# Altium project PCB_Project.PrjPcb
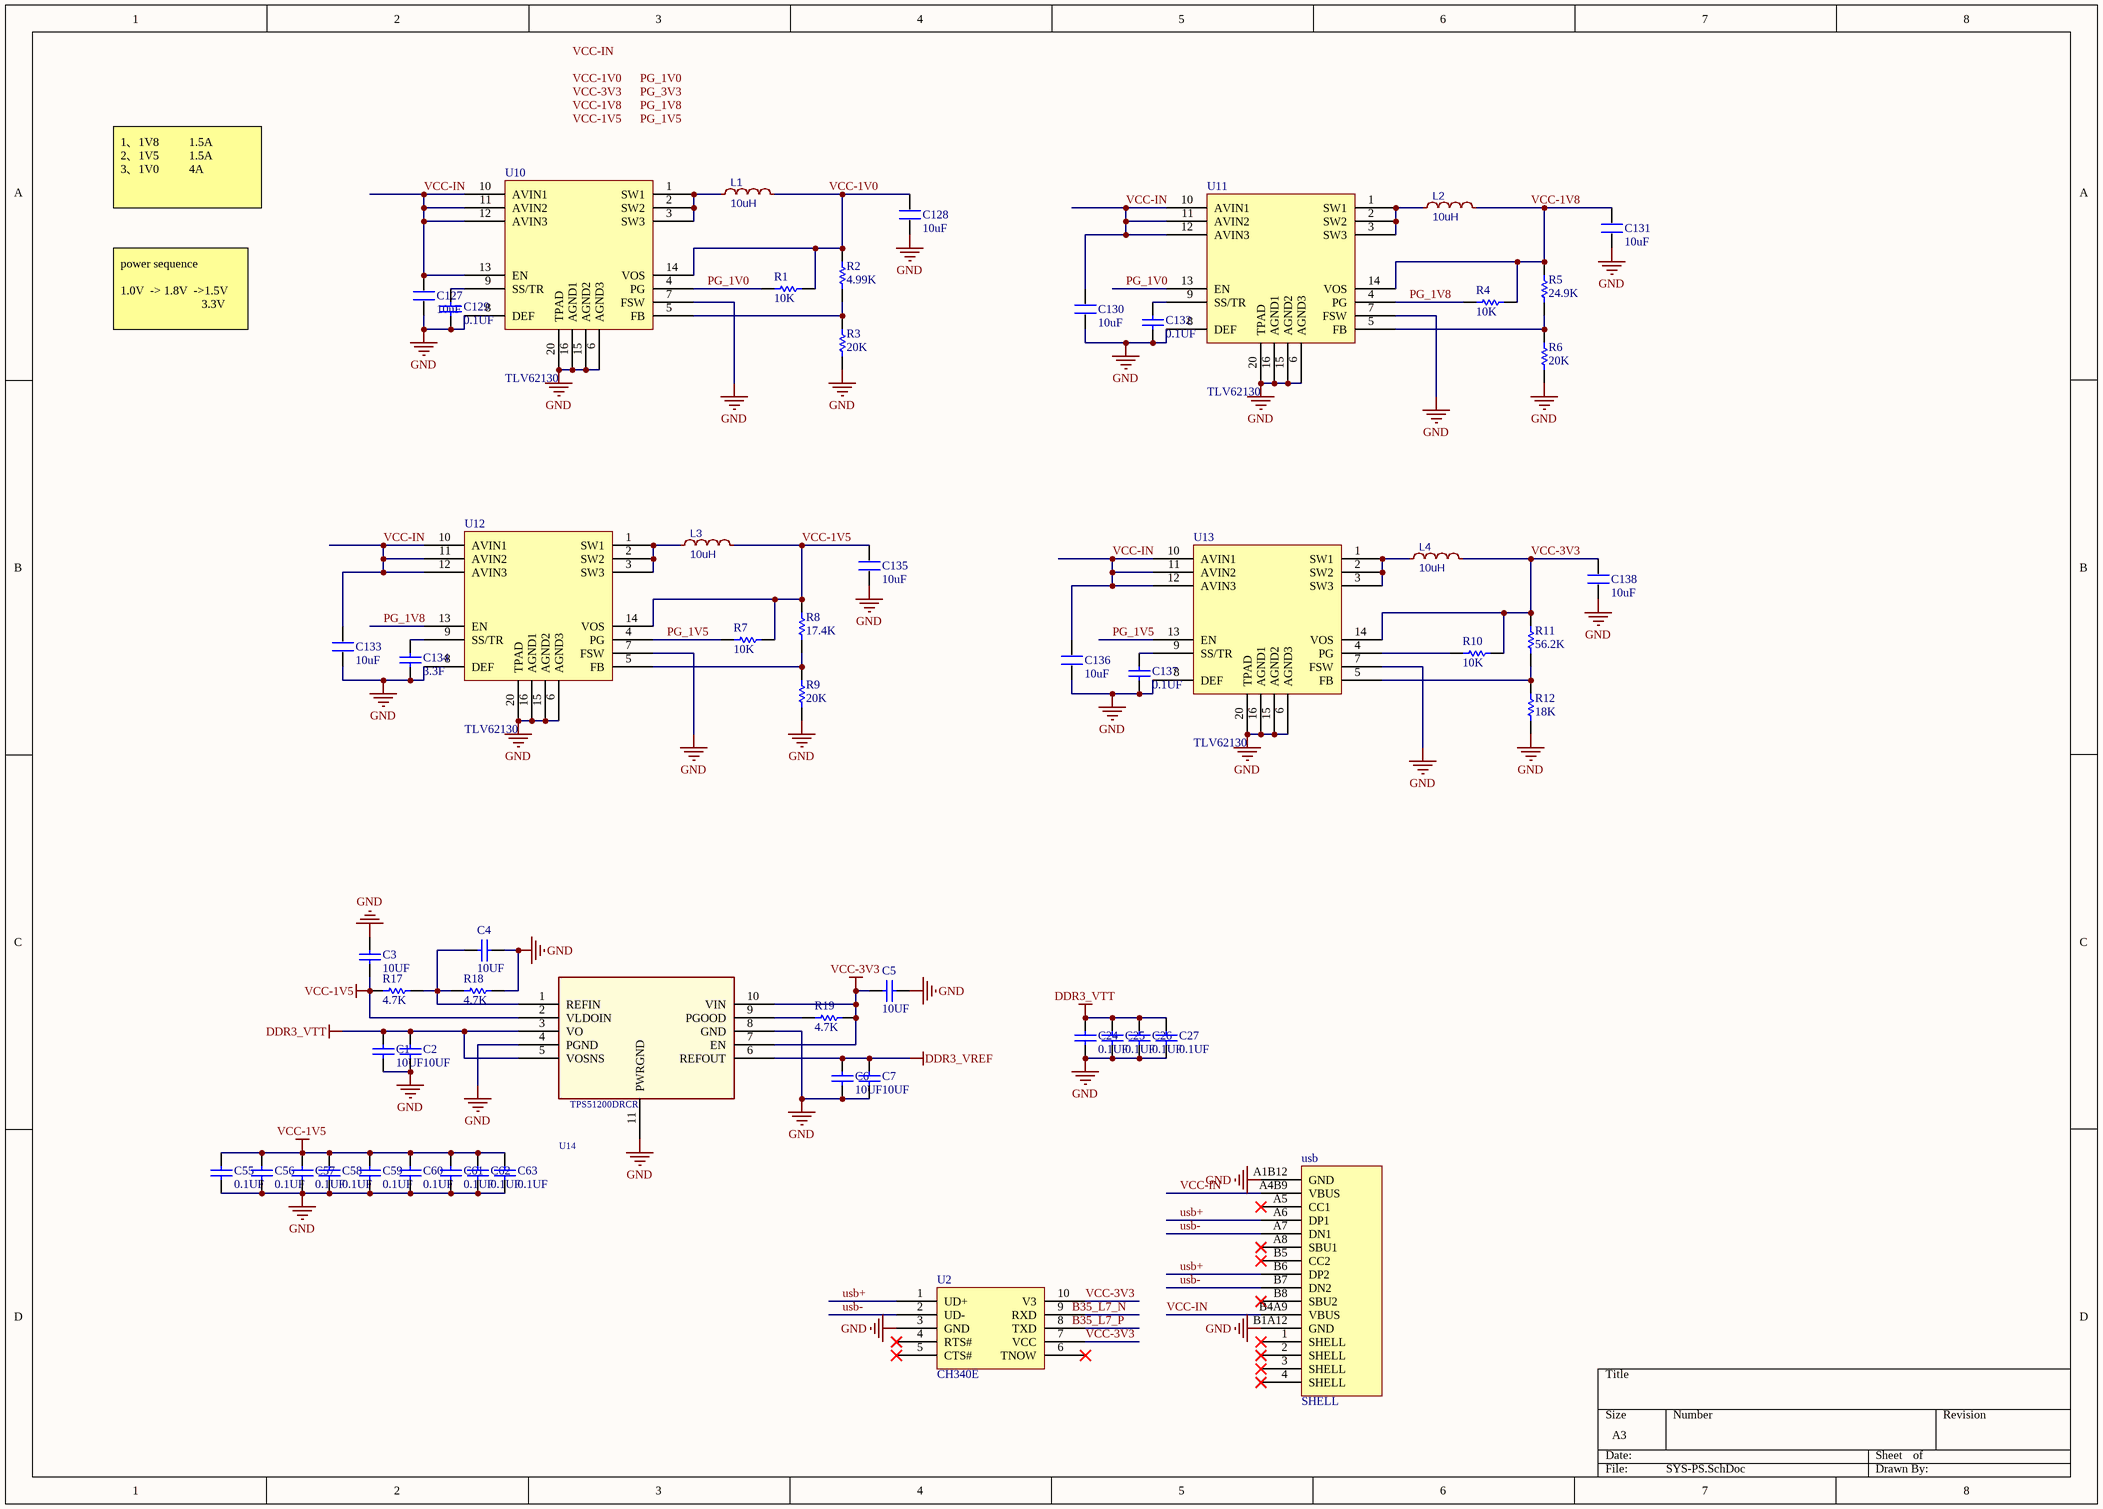
[diagram p0: SYS-PS.SchDoc]
6 sheets, 159 parts. Net scope: global (net labels, ports and power ports of the same name join across sheets).
Board file: PCB1.PcbDoc
Sheets:
  SYS-PS.SchDoc
  ZYNQ400-CONDIP.SchDoc
  ZYNQ400-DDR.SchDoc
  ZYNQ400-EMIO.SchDoc
  ZYNQ400-MIO.SchDoc
  ZYNQ400-POWER.SchDoc

## Sheet SYS-PS.SchDoc
size A3

### Parts
C1  10UF  [0402]
C2  10UF  [0402]
C3  10UF  [0402]
C4  10UF  [0402]
C5  10UF  [0402]
C6  10UF  [0402]
C7  10UF  [0402]
C24  0.1UF  [0402]
C25  0.1UF  [0402]
C26  0.1UF  [0402]
C27  0.1UF  [0402]
C55  0.1UF  [0402]
C56  0.1UF  [0402]
C57  0.1UF  [0402]
C58  0.1UF  [0402]
C59  0.1UF  [0402]
C60  0.1UF  [0402]
C61  0.1UF  [0402]
C62  0.1UF  [0402]
C63  0.1UF  [0402]
C127  10uF  [C0805]
C128  10uF  [C0805]
C129  0.1UF  [0402]
C130  10uF  [C0805]
C131  10uF  [C0805]
C132  0.1UF  [0402]
C133  10uF  [C0805]
C134  3.3F  [0402]
C135  10uF  [C0805]
C136  10uF  [C0805]
C137  0.1UF  [0402]
C138  10uF  [C0805]
L1  10uH  [L1008]
L2  10uH  [L1008]
L3  10uH  [L1008]
L4  10uH  [L1008]
R1  10K  [0402]
R2  4.99K  [0402]
R3  20K  [0402]
R4  10K  [0402]
R5  value 24.9K  [0402]  (hidden comment: 4.99K)
R6  value 20K  [0402]  (hidden comment: 15K)
R7  10K  [0402]
R8  value 17.4K  [0402]  (hidden comment: 4.99K)
R9  value 20K  [0402]  (hidden comment: 15K)
R10  10K  [0402]
R11  value 56.2K  [0402]  (hidden comment: 4.99K)
R12  value 18K  [0402]  (hidden comment: 15K)
R17  value 4.7K  [0402]  (hidden comment: 1K)
R18  value 4.7K  [0402]  (hidden comment: 1K)
R19  value 4.7K  [0402]  (hidden comment: 1K)
U2  CH340E  [CH340E]
U10  TLV62130  [TLV62130RGT]
U11  TLV62130  [TLV62130RGT]
U12  TLV62130  [TLV62130RGT]
U13  TLV62130  [TLV62130RGT]
U14  TPS51200DRCR  [TPS_QFN10]
usb  SHELL  [USB-C-SMD_TYPE-C16PIN_C668624]

### Nets
DDR3_VREF: C6.2 C7.2 U14.6(REFOUT)
DDR3_VTT: C1.2 C2.2 C24.2 C25.2 C26.2 C27.2 U14.3(VO) U14.5(VOSNS)
GND: C1.1 C2.1 C3.1 C4.2 C5.2 C6.1 C7.1 C24.1 C25.1 C26.1 C27.1 C55.1 C56.1 C57.1 C58.1 C59.1 C60.1 C61.1 C62.1 C63.1 C127.1 C128.1 C129.1 C130.1 C131.1 C132.1 C133.1 C134.1 C135.1 C136.1 C137.1 C138.1 R3.1 R6.1 R9.1 R12.1 R18.2 U2.3(GND) U10.6(AGND3) U10.7(FSW) U10.8(DEF) U10.15(AGND2) U10.16(AGND1) U10.20(TPAD) U11.6(AGND3) U11.7(FSW) U11.8(DEF) U11.15(AGND2) U11.16(AGND1) U11.20(TPAD) U12.6(AGND3) U12.7(FSW) U12.8(DEF) U12.15(AGND2) U12.16(AGND1) U12.20(TPAD) U13.6(AGND3) U13.7(FSW) U13.8(DEF) U13.15(AGND2) U13.16(AGND1) U13.20(TPAD) U14.4(PGND) U14.8(GND) U14.11(PWRGND) usb.A1B12(GND) usb.B1A12(GND)
VCC-1V5: C3.2 C55.2 C56.2 C57.2 C58.2 C59.2 C60.2 C61.2 C62.2 C63.2 C135.2 L3.2 R7.2 R8.2 R17.1 U12.14(VOS) U14.2(VLDOIN)
VCC-3V3: C5.1 C138.2 L4.2 R10.2 R11.2 R19.2 U2.7(VCC) U2.10(V3) U13.14(VOS) U14.7(EN) U14.10(VIN)
PG_1V0: R1.1 U10.4(PG) U11.13(EN)
PG_1V5: R7.1 U12.4(PG) U13.13(EN)
PG_1V8: R4.1 U11.4(PG) U12.13(EN)
usb+: U2.1(UD+) usb.A6(DP1) usb.B6(DP2)
usb-: U2.2(UD-) usb.A7(DN1) usb.B7(DN2)
VCC-1V0: C128.2 L1.2 R1.2 R2.2 U10.14(VOS)
VCC-1V8: C131.2 L2.2 R4.2 R5.2 U11.14(VOS)
VCC-IN: C127.2 C130.2 C133.2 C136.2 U10.10(AVIN1) U10.11(AVIN2) U10.12(AVIN3) U10.13(EN) U11.10(AVIN1) U11.11(AVIN2) U11.12(AVIN3) U12.10(AVIN1) U12.11(AVIN2) U12.12(AVIN3) U13.10(AVIN1) U13.11(AVIN2) U13.12(AVIN3) usb.A4B9(VBUS) usb.B4A9(VBUS)
NetC4_1: C4.1 R17.2 R18.1 U14.1(REFIN)
NetC129_2: C129.2 U10.9(SS/TR)
NetC132_2: C132.2 U11.9(SS/TR)
NetC134_2: C134.2 U12.9(SS/TR)
NetC137_2: C137.2 U13.9(SS/TR)
NetL1_1: L1.1 U10.1(SW1) U10.2(SW2) U10.3(SW3)
NetL2_1: L2.1 U11.1(SW1) U11.2(SW2) U11.3(SW3)
NetL3_1: L3.1 U12.1(SW1) U12.2(SW2) U12.3(SW3)
NetL4_1: L4.1 U13.1(SW1) U13.2(SW2) U13.3(SW3)
NetR2_1: R2.1 R3.2 U10.5(FB)
NetR5_1: R5.1 R6.2 U11.5(FB)
NetR8_1: R8.1 R9.2 U12.5(FB)
NetR10_1: R10.1 U13.4(PG)
NetR11_1: R11.1 R12.2 U13.5(FB)
NetR19_1: R19.1 U14.9(PGOOD)

Not connected (* = marked no-connect by the designer): U2 4(RTS#)* 5(CTS#)* 6(TNOW)* 8(TXD) 9(RXD); usb 1(SHELL)* 2(SHELL)* 3(SHELL)* 4(SHELL)* A5(CC1)* A8(SBU1)* B5(CC2)* B8(SBU2)*

### Notes on the sheet
- 1、1V8          1.5A
  2、1V5          1.5A
  3、1V0          4A
- power sequence
  1.0V  -> 1.8V  ->1.5V
  3.3V
- Labels drawn without touching a wire or pin: B35_L7_N, B35_L7_P, PG_1V0, PG_1V5, PG_1V8, PG_3V3, VCC-1V0, VCC-1V5, VCC-1V8, VCC-3V3, VCC-IN

### Library data of the parts
C1-C7 C24-C27 C55-C63 = Cap: Capacitor; Published: 8-Jun-2000; LatestRevisionDate: 17-Jul-2002; LatestRevisionNote: Re-released for DXP Platform.; PackageReference: RAD-0.3; Publisher: Altium Limited; PackageDescription: Radial Cap, Thru-Hole; 2 Leads; 0.3 in Pin Spacing
  C1-C7: Value: 10UF
  C24-C27 C55-C63: Value: 0.1UF
C127 C128 C130 C131 C133 C135 C136 C138 = C
C129 C132 C134 C137 = Cap: Capacitor; Value: 3.3nF; Published: 8-Jun-2000; LatestRevisionDate: 17-Jul-2002; LatestRevisionNote: Re-released for DXP Platform.; PackageReference: RAD-0.3; Publisher: Altium Limited; PackageDescription: Radial Cap, Thru-Hole; 2 Leads; 0.3 in Pin Spacing
L1-L4 = 10uH: BOM_Manufacturer: Sunlord; BOM_Manufacturer Part: MPL2520S100MWT; nameAlias: Inductance; Contributor: LCSC; BOM_Supplier: LCSC; BOM_Supplier Part: C370039; spicePre: L; spiceSymbolName: MPL2520S100MWT
R1-R12 R17-R19 = Res1: Resistor; Published: 8-Jun-2000; LatestRevisionDate: 17-Jul-2002; LatestRevisionNote: Re-released for DXP Platform.; PackageReference: AXIAL-0.3; Publisher: Altium Limited; PackageDescription: Axial Device, Thru-Hole; 2 Leads; 0.3 in Pin Spacing
  R1 R4 R7 R10: Value: 10K
  R2: Value: 4.99K
  R3: Value: 20K
usb = typec_16p

## Sheet ZYNQ400-CONDIP.SchDoc
size A3
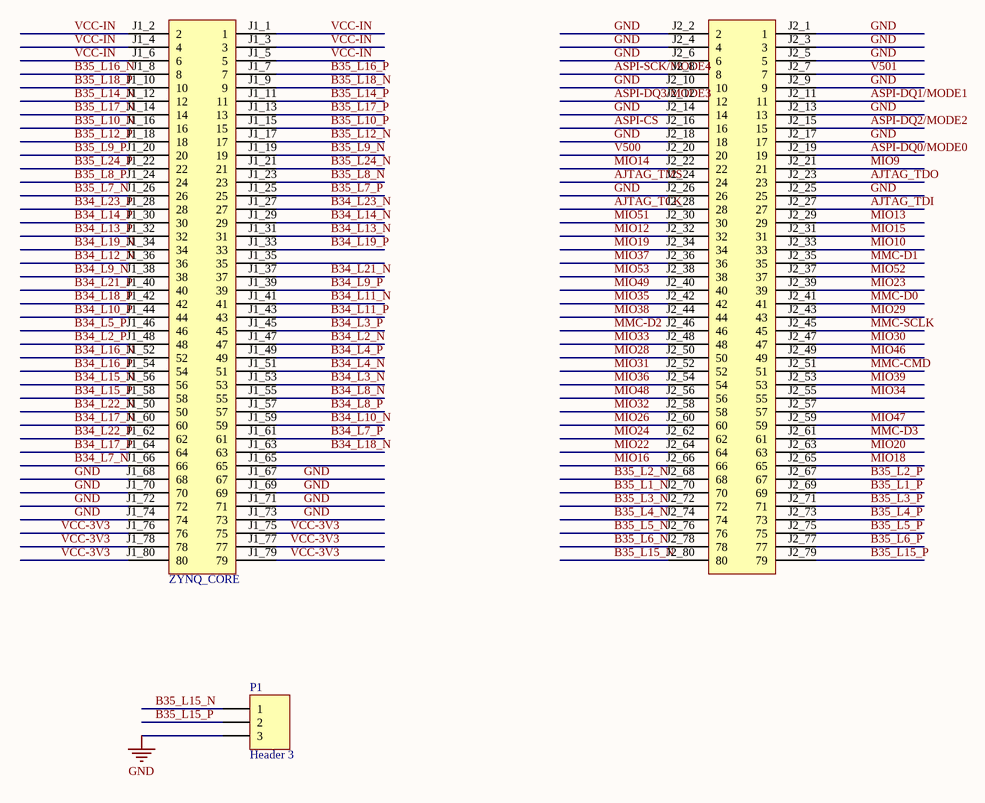
[diagram p1: ZYNQ400-CONDIP.SchDoc]

### Parts
M1  ZYNQ_CORE  [ZYNQ7010&7020]
P1  Header 3  [HDR1X3]

### Nets
GND: M1.J1_67(67) M1.J1_68(68) M1.J1_69(69) M1.J1_70(70) M1.J1_71(71) M1.J1_72(72) M1.J1_73(73) M1.J1_74(74) M1.J2_1(1) M1.J2_2(2) M1.J2_3(3) M1.J2_4(4) M1.J2_5(5) M1.J2_6(6) M1.J2_9(9) M1.J2_10(10) M1.J2_13(13) M1.J2_14(14) M1.J2_17(17) M1.J2_18(18) M1.J2_25(25) M1.J2_26(26) P1.3
VCC-3V3: M1.J1_75(75) M1.J1_76(76) M1.J1_77(77) M1.J1_78(78) M1.J1_79(79) M1.J1_80(80)
AJTAG_TCK: M1.J2_28(28)
AJTAG_TDI: M1.J2_27(27)
AJTAG_TDO: M1.J2_23(23)
AJTAG_TMS: M1.J2_24(24)
ASPI-CS: M1.J2_16(16)
ASPI-DQ0/MODE0: M1.J2_19(19)
ASPI-DQ1/MODE1: M1.J2_11(11)
ASPI-DQ2/MODE2: M1.J2_15(15)
ASPI-DQ3/MODE3: M1.J2_12(12)
ASPI-SCK/MODE4: M1.J2_8(8)
B34_L2_N: M1.J1_47(47)
B34_L2_P: M1.J1_48(48)
B34_L3_N: M1.J1_53(53)
B34_L3_P: M1.J1_45(45)
B34_L4_N: M1.J1_51(51)
B34_L4_P: M1.J1_49(49)
B34_L5_P: M1.J1_46(46)
B34_L7_N: M1.J1_66(66)
B34_L7_P: M1.J1_61(61)
B34_L8_N: M1.J1_55(55)
B34_L8_P: M1.J1_57(57)
B34_L9_N: M1.J1_38(38)
B34_L9_P: M1.J1_39(39)
B34_L10_N: M1.J1_59(59)
B34_L10_P: M1.J1_44(44)
B34_L11_N: M1.J1_41(41)
B34_L11_P: M1.J1_43(43)
B34_L12_N: M1.J1_36(36)
B34_L13_N: M1.J1_31(31)
B34_L13_P: M1.J1_32(32)
B34_L14_N: M1.J1_29(29)
B34_L14_P: M1.J1_30(30)
B34_L15_N: M1.J1_56(56)
B34_L15_P: M1.J1_58(58)
B34_L16_N: M1.J1_52(52)
B34_L16_P: M1.J1_54(54)
B34_L17_N: M1.J1_60(60)
B34_L17_P: M1.J1_64(64)
B34_L18_N: M1.J1_63(63)
B34_L18_P: M1.J1_42(42)
B34_L19_N: M1.J1_34(34)
B34_L19_P: M1.J1_33(33)
B34_L21_N: M1.J1_37(37)
B34_L21_P: M1.J1_40(40)
B34_L22_N: M1.J1_50(50)
B34_L22_P: M1.J1_62(62)
B34_L23_N: M1.J1_27(27)
B34_L23_P: M1.J1_28(28)
B35_L1_N: M1.J2_70(70)
B35_L1_P: M1.J2_69(69)
B35_L2_N: M1.J2_68(68)
B35_L2_P: M1.J2_67(67)
B35_L3_N: M1.J2_72(72)
B35_L3_P: M1.J2_71(71)
B35_L4_N: M1.J2_74(74)
B35_L4_P: M1.J2_73(73)
B35_L5_N: M1.J2_76(76)
B35_L5_P: M1.J2_75(75)
B35_L6_N: M1.J2_78(78)
B35_L6_P: M1.J2_77(77)
B35_L7_N: M1.J1_26(26)
B35_L7_P: M1.J1_25(25)
B35_L8_N: M1.J1_23(23)
B35_L8_P: M1.J1_24(24)
B35_L9_N: M1.J1_19(19)
B35_L9_P: M1.J1_20(20)
B35_L10_N: M1.J1_16(16)
B35_L10_P: M1.J1_15(15)
B35_L12_N: M1.J1_17(17)
B35_L12_P: M1.J1_18(18)
B35_L14_N: M1.J1_12(12)
B35_L14_P: M1.J1_11(11)
B35_L15_N: M1.J2_80(80) P1.1
B35_L15_P: M1.J2_79(79) P1.2
B35_L16_N: M1.J1_8(8)
B35_L16_P: M1.J1_7(7)
B35_L17_N: M1.J1_14(14)
B35_L17_P: M1.J1_13(13)
B35_L18_N: M1.J1_9(9)
B35_L18_P: M1.J1_10(10)
B35_L24_N: M1.J1_21(21)
B35_L24_P: M1.J1_22(22)
MIO9: M1.J2_21(21)
MIO10: M1.J2_33(33)
MIO12: M1.J2_32(32)
MIO13: M1.J2_29(29)
MIO14: M1.J2_22(22)
MIO15: M1.J2_31(31)
MIO16: M1.J2_66(66)
MIO18: M1.J2_65(65)
MIO19: M1.J2_34(34)
MIO20: M1.J2_63(63)
MIO22: M1.J2_64(64)
MIO23: M1.J2_39(39)
MIO24: M1.J2_62(62)
MIO26: M1.J2_60(60)
MIO28: M1.J2_50(50)
MIO29: M1.J2_43(43)
MIO30: M1.J2_47(47)
MIO31: M1.J2_52(52)
MIO32: M1.J2_58(58)
MIO33: M1.J2_48(48)
MIO34: M1.J2_55(55)
MIO35: M1.J2_42(42)
MIO36: M1.J2_54(54)
MIO37: M1.J2_36(36)
MIO38: M1.J2_44(44)
MIO39: M1.J2_53(53)
MIO46: M1.J2_49(49)
MIO47: M1.J2_59(59)
MIO48: M1.J2_56(56)
MIO49: M1.J2_40(40)
MIO51: M1.J2_30(30)
MIO52: M1.J2_37(37)
MIO53: M1.J2_38(38)
MMC-CMD: M1.J2_51(51)
MMC-D0: M1.J2_41(41)
MMC-D1: M1.J2_35(35)
MMC-D2: M1.J2_46(46)
MMC-D3: M1.J2_61(61)
MMC-SCLK: M1.J2_45(45)
V500: M1.J2_20(20)
V501: M1.J2_7(7)
VCC-IN: M1.J1_1(1) M1.J1_2(2) M1.J1_3(3) M1.J1_4(4) M1.J1_5(5) M1.J1_6(6)

Not connected (* = marked no-connect by the designer): M1 J1_35(35) J1_65(65) J2_57(57)

### Library data of the parts
M1 = ZYNQ7010&7020: ZYNQ7010&7020 Core Board
P1 = Header 3: Header, 3-Pin; LatestRevisionDate: 17-Jul-2002; LatestRevisionNote: Re-released for DXP Platform.; Publisher: Altium Limited

## Sheet ZYNQ400-DDR.SchDoc
size A3
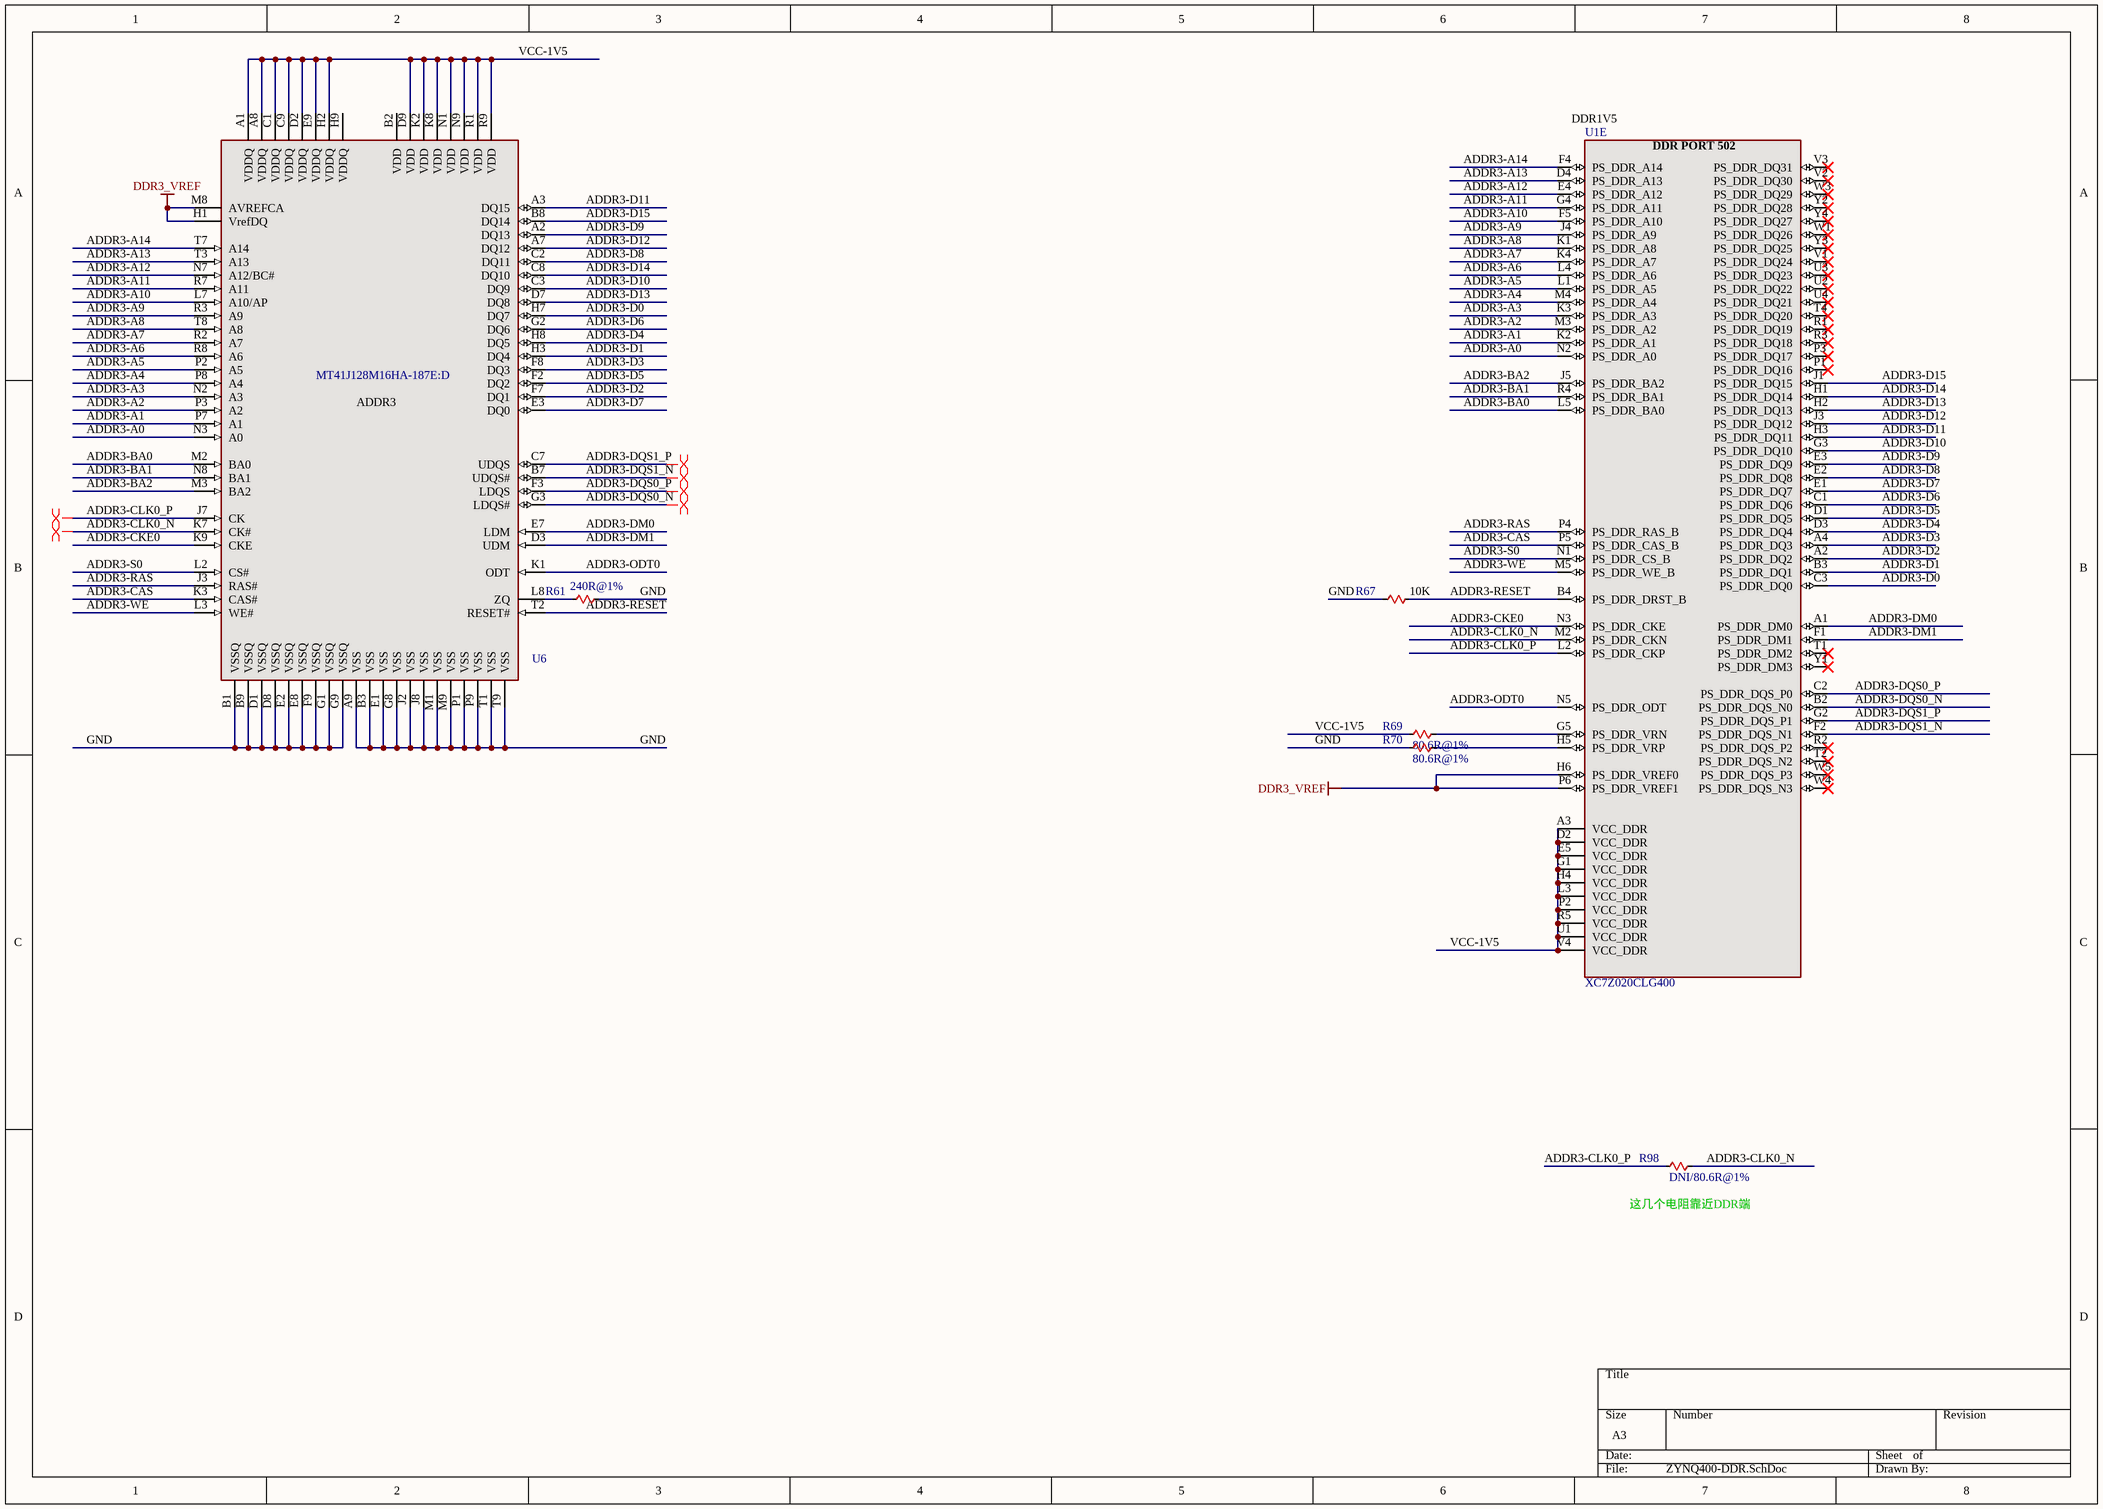
[diagram p2: ZYNQ400-DDR.SchDoc]

### Parts
R61  240R@1%  [0402]
R67  10K  [0402]
R69  80.6R@1%  [0402]
R70  80.6R@1%  [0402]
R98  DNI/80.6R@1%  [0402]
U1  XC7Z020CLG400  [CLG400]  (part E of 9)
U6  MT41J128M16HA-187E:D  [FBGA96]

### Nets
DDR3_VREF: U1.H6(PS_DDR_VREF0) U1.P6(PS_DDR_VREF1) U6.H1(VrefDQ) U6.M8(AVREFCA)
GND: R61.2 R67.2 R70.1 U6.A9(VSS) U6.B1(VSSQ) U6.B3(VSS) U6.B9(VSSQ) U6.D1(VSSQ) U6.D8(VSSQ) U6.E1(VSS) U6.E2(VSSQ) U6.E8(VSSQ) U6.F9(VSSQ) U6.G1(VSSQ) U6.G8(VSS) U6.G9(VSSQ) U6.J2(VSS) U6.J8(VSS) U6.M1(VSS) U6.M9(VSS) U6.P1(VSS) U6.P9(VSS) U6.T1(VSS) U6.T9(VSS)
VCC-1V5: R69.1 U1.A3(VCC_DDR) U1.D2(VCC_DDR) U1.E5(VCC_DDR) U1.G1(VCC_DDR) U1.H4(VCC_DDR) U1.L3(VCC_DDR) U1.P2(VCC_DDR) U1.R5(VCC_DDR) U1.U1(VCC_DDR) U1.V4(VCC_DDR) U6.A1(VDDQ) U6.A8(VDDQ) U6.C1(VDDQ) U6.C9(VDDQ) U6.D2(VDDQ) U6.D9(VDD) U6.E9(VDDQ) U6.H2(VDDQ) U6.K2(VDD) U6.K8(VDD) U6.N1(VDD) U6.N9(VDD) U6.R1(VDD) U6.R9(VDD)
ADDR3-A0: U1.N2(PS_DDR_A0) U6.N3(A0)
ADDR3-A1: U1.K2(PS_DDR_A1) U6.P7(A1)
ADDR3-A2: U1.M3(PS_DDR_A2) U6.P3(A2)
ADDR3-A3: U1.K3(PS_DDR_A3) U6.N2(A3)
ADDR3-A4: U1.M4(PS_DDR_A4) U6.P8(A4)
ADDR3-A5: U1.L1(PS_DDR_A5) U6.P2(A5)
ADDR3-A6: U1.L4(PS_DDR_A6) U6.R8(A6)
ADDR3-A7: U1.K4(PS_DDR_A7) U6.R2(A7)
ADDR3-A8: U1.K1(PS_DDR_A8) U6.T8(A8)
ADDR3-A9: U1.J4(PS_DDR_A9) U6.R3(A9)
ADDR3-A10: U1.F5(PS_DDR_A10) U6.L7(A10/AP)
ADDR3-A11: U1.G4(PS_DDR_A11) U6.R7(A11)
ADDR3-A12: U1.E4(PS_DDR_A12) U6.N7(A12/BC#)
ADDR3-A13: U1.D4(PS_DDR_A13) U6.T3(A13)
ADDR3-A14: U1.F4(PS_DDR_A14) U6.T7(A14)
ADDR3-BA0: U1.L5(PS_DDR_BA0) U6.M2(BA0)
ADDR3-BA1: U1.R4(PS_DDR_BA1) U6.N8(BA1)
ADDR3-BA2: U1.J5(PS_DDR_BA2) U6.M3(BA2)
ADDR3-CAS: U1.P5(PS_DDR_CAS_B) U6.K3(CAS#)
ADDR3-CKE0: U1.N3(PS_DDR_CKE) U6.K9(CKE)
ADDR3-CLK0_N: R98.2 U1.M2(PS_DDR_CKN) U6.K7(CK#)
ADDR3-CLK0_P: R98.1 U1.L2(PS_DDR_CKP) U6.J7(CK)
ADDR3-D0: U1.C3(PS_DDR_DQ0) U6.H7(DQ7)
ADDR3-D1: U1.B3(PS_DDR_DQ1) U6.H3(DQ4)
ADDR3-D2: U1.A2(PS_DDR_DQ2) U6.F7(DQ1)
ADDR3-D3: U1.A4(PS_DDR_DQ3) U6.F8(DQ3)
ADDR3-D4: U1.D3(PS_DDR_DQ4) U6.H8(DQ5)
ADDR3-D5: U1.D1(PS_DDR_DQ5) U6.F2(DQ2)
ADDR3-D6: U1.C1(PS_DDR_DQ6) U6.G2(DQ6)
ADDR3-D7: U1.E1(PS_DDR_DQ7) U6.E3(DQ0)
ADDR3-D8: U1.E2(PS_DDR_DQ8) U6.C2(DQ11)
ADDR3-D9: U1.E3(PS_DDR_DQ9) U6.A2(DQ13)
ADDR3-D10: U1.G3(PS_DDR_DQ10) U6.C3(DQ9)
ADDR3-D11: U1.H3(PS_DDR_DQ11) U6.A3(DQ15)
ADDR3-D12: U1.J3(PS_DDR_DQ12) U6.A7(DQ12)
ADDR3-D13: U1.H2(PS_DDR_DQ13) U6.D7(DQ8)
ADDR3-D14: U1.H1(PS_DDR_DQ14) U6.C8(DQ10)
ADDR3-D15: U1.J1(PS_DDR_DQ15) U6.B8(DQ14)
ADDR3-DM0: U1.A1(PS_DDR_DM0) U6.E7(LDM)
ADDR3-DM1: U1.F1(PS_DDR_DM1) U6.D3(UDM)
ADDR3-DQS0_N: U1.B2(PS_DDR_DQS_N0) U6.G3(LDQS#)
ADDR3-DQS0_P: U1.C2(PS_DDR_DQS_P0) U6.F3(LDQS)
ADDR3-DQS1_N: U1.F2(PS_DDR_DQS_N1) U6.B7(UDQS#)
ADDR3-DQS1_P: U1.G2(PS_DDR_DQS_P1) U6.C7(UDQS)
ADDR3-ODT0: U1.N5(PS_DDR_ODT) U6.K1(ODT)
ADDR3-RAS: U1.P4(PS_DDR_RAS_B) U6.J3(RAS#)
ADDR3-RESET: R67.1 U1.B4(PS_DDR_DRST_B) U6.T2(RESET#)
ADDR3-S0: U1.N1(PS_DDR_CS_B) U6.L2(CS#)
ADDR3-WE: U1.M5(PS_DDR_WE_B) U6.L3(WE#)
NetR61_1: R61.1 U6.L8(ZQ)
NetR69_2: R69.2 U1.G5(PS_DDR_VRN)
NetR70_2: R70.2 U1.H5(PS_DDR_VRP)

Not connected (* = marked no-connect by the designer): U1 P1(PS_DDR_DQ16)* P3(PS_DDR_DQ17)* R1(PS_DDR_DQ19)* R2(PS_DDR_DQS_P2)* R3(PS_DDR_DQ18)* T1(PS_DDR_DM2)* T2(PS_DDR_DQS_N2)* T4(PS_DDR_DQ20)* U2(PS_DDR_DQ22)* U3(PS_DDR_DQ23)* U4(PS_DDR_DQ21)* V1(PS_DDR_DQ24)* V2(PS_DDR_DQ30)* V3(PS_DDR_DQ31)* W1(PS_DDR_DQ26)* W3(PS_DDR_DQ29)* W4(PS_DDR_DQS_N3)* W5(PS_DDR_DQS_P3)* Y1(PS_DDR_DM3)* Y2(PS_DDR_DQ28)* Y3(PS_DDR_DQ25)* Y4(PS_DDR_DQ27)*; U6 B2(VDD) H9(VDDQ)

### Layout directives
differential pair: ADDR3-CLK0_N, ADDR3-CLK0_P, ADDR3-DQS0_N, ADDR3-DQS0_P, ADDR3-DQS1_N, ADDR3-DQS1_P

### Notes on the sheet
- (near U1) DDR1V5
- (near R98) 这几个电阻靠近DDR端
- (in symbol MT41JxxxMxx) ADDR3
- (in symbol XC7Z020-CLG400, part E) DDR PORT 502

### Library data of the parts
R61 = RESISTOR: Generic Resistor; Value: 240R; Manufacturer: *; DPN: *
R67 = RESISTOR: Generic Resistor; Manufacturer: *; DPN: *; Value: 10K
R69 R70 R98 = RESISTOR: Generic Resistor; Value: 80.6R; Manufacturer: *; DPN: *
U1 = XC7Z020-CLG400: Zynq 7000 FPGA 20 Die, in a CSG 484 Package; Manufacturer: Xilinx; DPN: *; Die: *
U6 = MT41JxxxMxx: DDR3 SDRAM 2Gb x4, x8, x16; Manufacturer: Micron; DPN: *

## Sheet ZYNQ400-EMIO.SchDoc
size A3
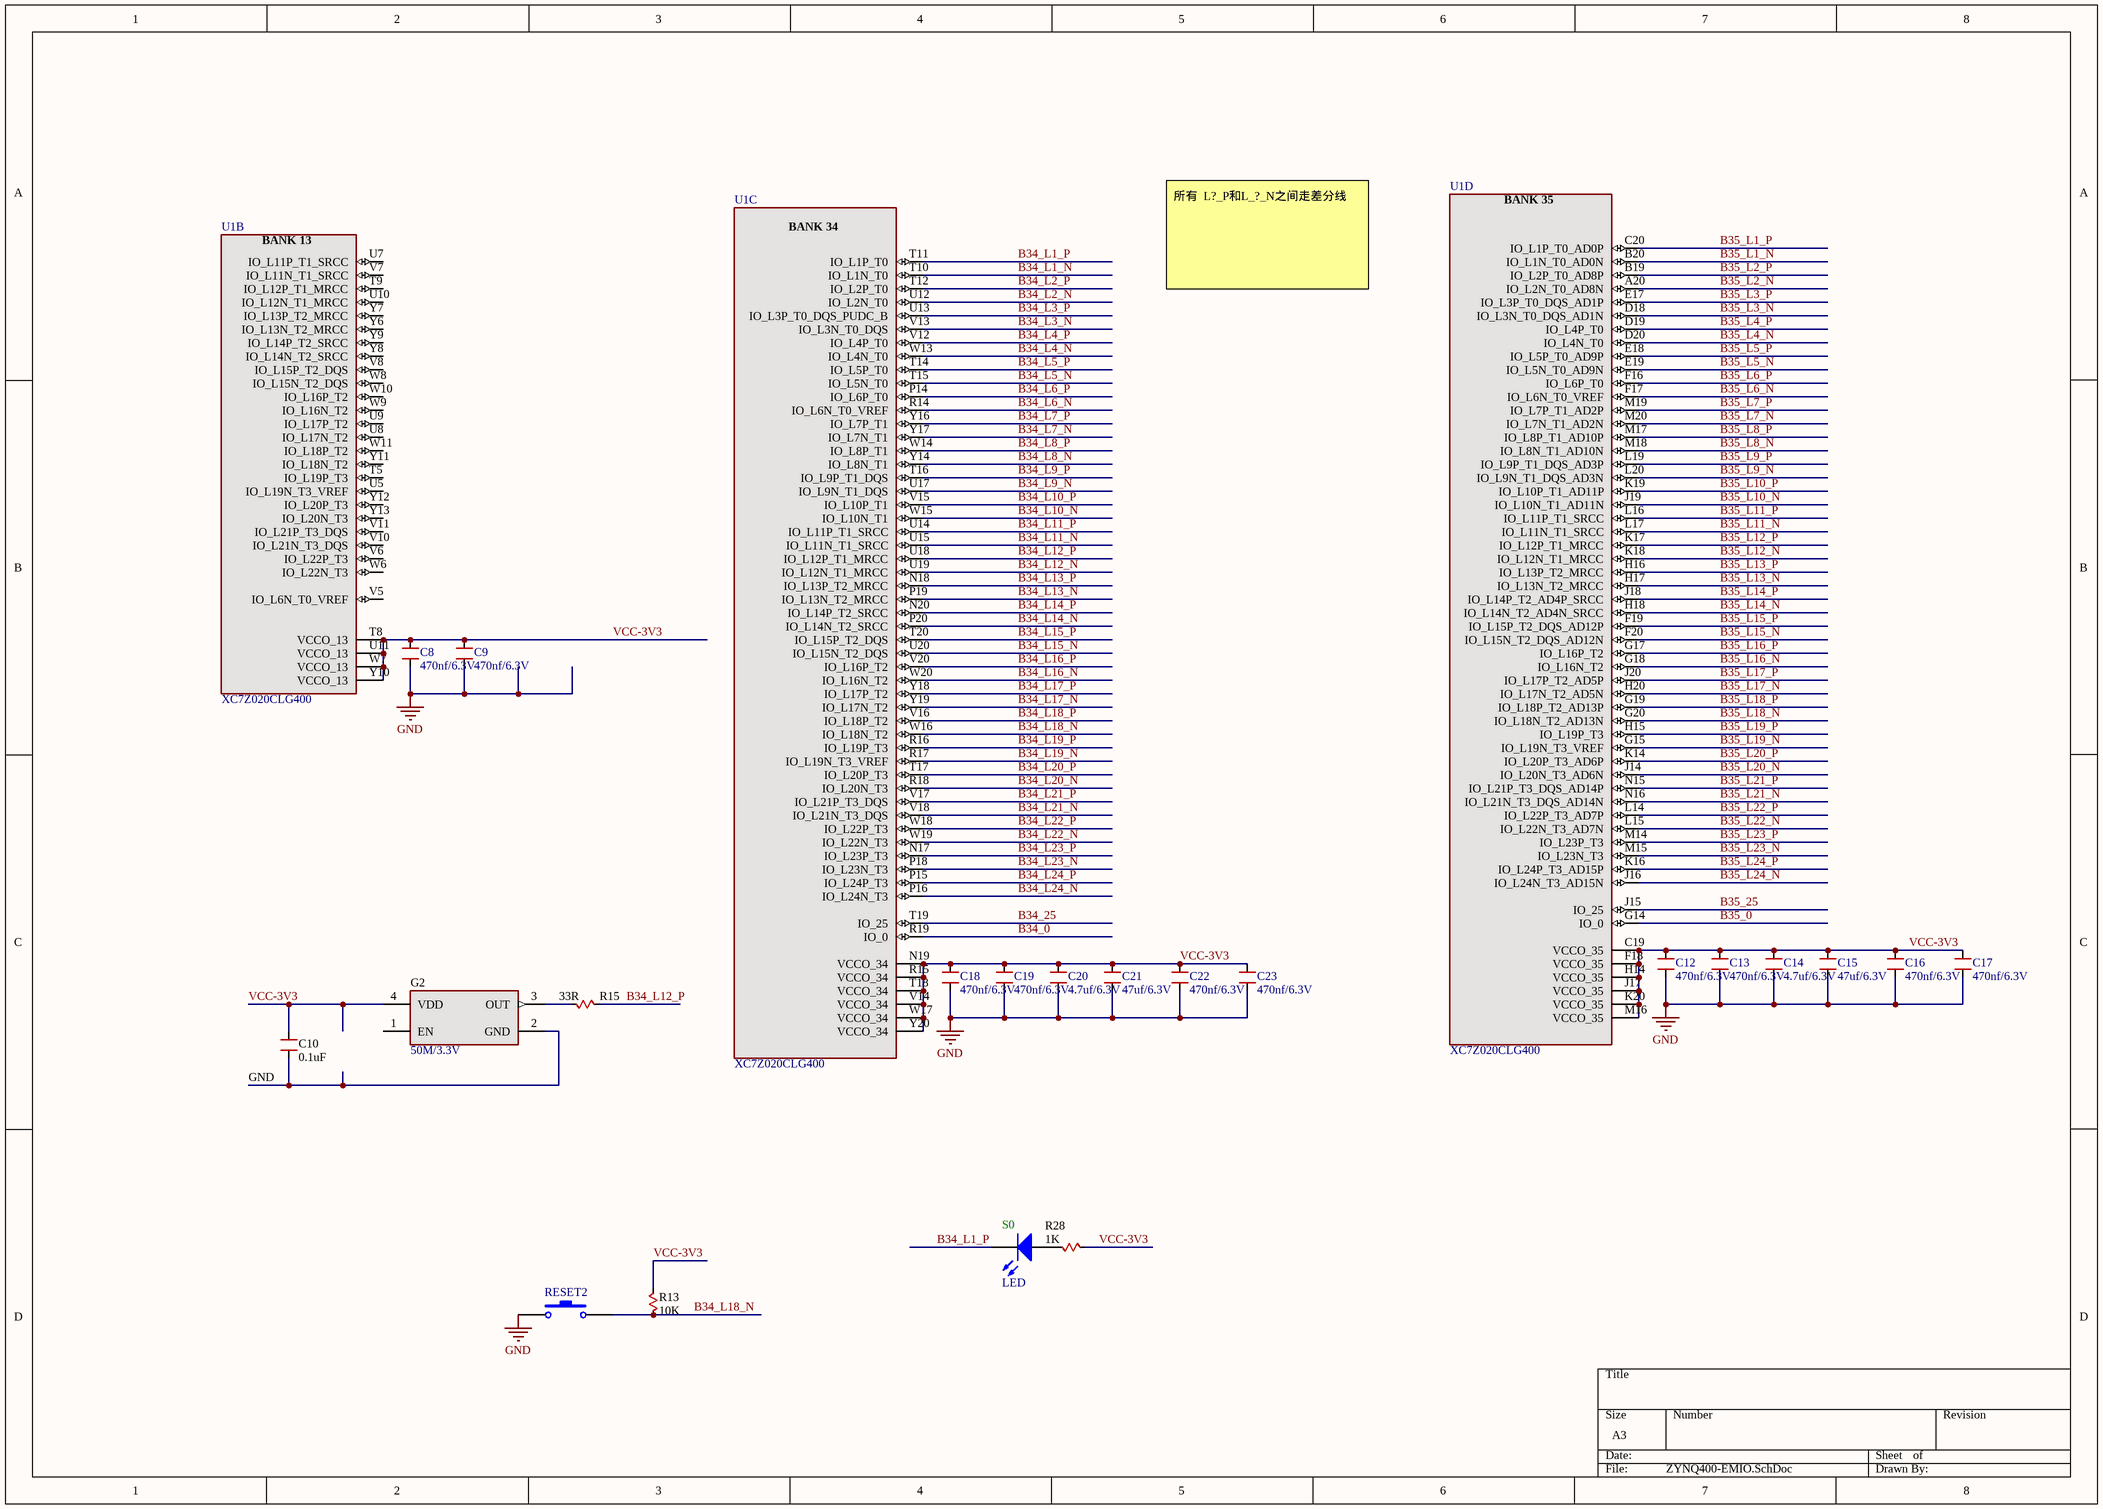
[diagram p3: ZYNQ400-EMIO.SchDoc]

### Parts
C8  470nf/6.3V  [0402]
C9  470nf/6.3V  [0402]
C10  0.1UF  [0402]
C12  470nf/6.3V  [0402]
C13  470nf/6.3V  [0402]
C14  4.7uf/6.3V  [0402]
C15  47uf/6.3V  [0402]
C16  470nf/6.3V  [0402]
C17  470nf/6.3V  [0402]
C18  470nf/6.3V  [0402]
C19  470nf/6.3V  [0402]
C20  4.7uf/6.3V  [0402]
C21  47uf/6.3V  [0402]
C22  470nf/6.3V  [0402]
C23  470nf/6.3V  [0402]
G2  50M/3.3V  [3.2*2.5]
R13  10K  [0402]
R15  33R  [0402]
R28  1K  [0402]
RESET2  SW-PB  [micro button_2_SMD]  (value not drawn)
S0  LED  [D0402]
U1  XC7Z020CLG400  [CLG400]  (parts B,C,D of 9)

### Nets
GND: C8.2 C9.2 C10.2 C12.2 C13.2 C14.2 C15.2 C16.2 C17.2 C18.2 C19.2 C20.2 C21.2 C22.2 C23.2 G2.2(GND) RESET2.1
VCC-3V3: C8.1 C9.1 C10.1 C12.1 C13.1 C14.1 C15.1 C16.1 C17.1 C18.1 C19.1 C20.1 C21.1 C22.1 C23.1 G2.4(VDD) R13.2 R28.2 U1.C19(VCCO_35) U1.F18(VCCO_35) U1.H14(VCCO_35) U1.J17(VCCO_35) U1.K20(VCCO_35) U1.M16(VCCO_35) U1.N19(VCCO_34) U1.R15(VCCO_34) U1.T8(VCCO_13) U1.T18(VCCO_34) U1.U11(VCCO_13) U1.V14(VCCO_34) U1.W7(VCCO_13) U1.W17(VCCO_34) U1.Y10(VCCO_13) U1.Y20(VCCO_34)
B34_0: U1.R19(IO_0)
B34_25: U1.T19(IO_25)
B34_L1_N: U1.T10(IO_L1N_T0)
B34_L1_P: S0.2(K) U1.T11(IO_L1P_T0)
B34_L2_N: U1.U12(IO_L2N_T0)
B34_L2_P: U1.T12(IO_L2P_T0)
B34_L3_N: U1.V13(IO_L3N_T0_DQS)
B34_L3_P: U1.U13(IO_L3P_T0_DQS_PUDC_B)
B34_L4_N: U1.W13(IO_L4N_T0)
B34_L4_P: U1.V12(IO_L4P_T0)
B34_L5_N: U1.T15(IO_L5N_T0)
B34_L5_P: U1.T14(IO_L5P_T0)
B34_L6_N: U1.R14(IO_L6N_T0_VREF)
B34_L6_P: U1.P14(IO_L6P_T0)
B34_L7_N: U1.Y17(IO_L7N_T1)
B34_L7_P: U1.Y16(IO_L7P_T1)
B34_L8_N: U1.Y14(IO_L8N_T1)
B34_L8_P: U1.W14(IO_L8P_T1)
B34_L9_N: U1.U17(IO_L9N_T1_DQS)
B34_L9_P: U1.T16(IO_L9P_T1_DQS)
B34_L10_N: U1.W15(IO_L10N_T1)
B34_L10_P: U1.V15(IO_L10P_T1)
B34_L11_N: U1.U15(IO_L11N_T1_SRCC)
B34_L11_P: U1.U14(IO_L11P_T1_SRCC)
B34_L12_N: U1.U19(IO_L12N_T1_MRCC)
B34_L12_P: R15.2 U1.U18(IO_L12P_T1_MRCC)
B34_L13_N: U1.P19(IO_L13N_T2_MRCC)
B34_L13_P: U1.N18(IO_L13P_T2_MRCC)
B34_L14_N: U1.P20(IO_L14N_T2_SRCC)
B34_L14_P: U1.N20(IO_L14P_T2_SRCC)
B34_L15_N: U1.U20(IO_L15N_T2_DQS)
B34_L15_P: U1.T20(IO_L15P_T2_DQS)
B34_L16_N: U1.W20(IO_L16N_T2)
B34_L16_P: U1.V20(IO_L16P_T2)
B34_L17_N: U1.Y19(IO_L17N_T2)
B34_L17_P: U1.Y18(IO_L17P_T2)
B34_L18_N: R13.1 RESET2.2 U1.W16(IO_L18N_T2)
B34_L18_P: U1.V16(IO_L18P_T2)
B34_L19_N: U1.R17(IO_L19N_T3_VREF)
B34_L19_P: U1.R16(IO_L19P_T3)
B34_L20_N: U1.R18(IO_L20N_T3)
B34_L20_P: U1.T17(IO_L20P_T3)
B34_L21_N: U1.V18(IO_L21N_T3_DQS)
B34_L21_P: U1.V17(IO_L21P_T3_DQS)
B34_L22_N: U1.W19(IO_L22N_T3)
B34_L22_P: U1.W18(IO_L22P_T3)
B34_L23_N: U1.P18(IO_L23N_T3)
B34_L23_P: U1.N17(IO_L23P_T3)
B34_L24_N: U1.P16(IO_L24N_T3)
B34_L24_P: U1.P15(IO_L24P_T3)
B35_0: U1.G14(IO_0)
B35_25: U1.J15(IO_25)
B35_L1_N: U1.B20(IO_L1N_T0_AD0N)
B35_L1_P: U1.C20(IO_L1P_T0_AD0P)
B35_L2_N: U1.A20(IO_L2N_T0_AD8N)
B35_L2_P: U1.B19(IO_L2P_T0_AD8P)
B35_L3_N: U1.D18(IO_L3N_T0_DQS_AD1N)
B35_L3_P: U1.E17(IO_L3P_T0_DQS_AD1P)
B35_L4_N: U1.D20(IO_L4N_T0)
B35_L4_P: U1.D19(IO_L4P_T0)
B35_L5_N: U1.E19(IO_L5N_T0_AD9N)
B35_L5_P: U1.E18(IO_L5P_T0_AD9P)
B35_L6_N: U1.F17(IO_L6N_T0_VREF)
B35_L6_P: U1.F16(IO_L6P_T0)
B35_L7_N: U1.M20(IO_L7N_T1_AD2N)
B35_L7_P: U1.M19(IO_L7P_T1_AD2P)
B35_L8_N: U1.M18(IO_L8N_T1_AD10N)
B35_L8_P: U1.M17(IO_L8P_T1_AD10P)
B35_L9_N: U1.L20(IO_L9N_T1_DQS_AD3N)
B35_L9_P: U1.L19(IO_L9P_T1_DQS_AD3P)
B35_L10_N: U1.J19(IO_L10N_T1_AD11N)
B35_L10_P: U1.K19(IO_L10P_T1_AD11P)
B35_L11_N: U1.L17(IO_L11N_T1_SRCC)
B35_L11_P: U1.L16(IO_L11P_T1_SRCC)
B35_L12_N: U1.K18(IO_L12N_T1_MRCC)
B35_L12_P: U1.K17(IO_L12P_T1_MRCC)
B35_L13_N: U1.H17(IO_L13N_T2_MRCC)
B35_L13_P: U1.H16(IO_L13P_T2_MRCC)
B35_L14_N: U1.H18(IO_L14N_T2_AD4N_SRCC)
B35_L14_P: U1.J18(IO_L14P_T2_AD4P_SRCC)
B35_L15_N: U1.F20(IO_L15N_T2_DQS_AD12N)
B35_L15_P: U1.F19(IO_L15P_T2_DQS_AD12P)
B35_L16_N: U1.G18(IO_L16N_T2)
B35_L16_P: U1.G17(IO_L16P_T2)
B35_L17_N: U1.H20(IO_L17N_T2_AD5N)
B35_L17_P: U1.J20(IO_L17P_T2_AD5P)
B35_L18_N: U1.G20(IO_L18N_T2_AD13N)
B35_L18_P: U1.G19(IO_L18P_T2_AD13P)
B35_L19_N: U1.G15(IO_L19N_T3_VREF)
B35_L19_P: U1.H15(IO_L19P_T3)
B35_L20_N: U1.J14(IO_L20N_T3_AD6N)
B35_L20_P: U1.K14(IO_L20P_T3_AD6P)
B35_L21_N: U1.N16(IO_L21N_T3_DQS_AD14N)
B35_L21_P: U1.N15(IO_L21P_T3_DQS_AD14P)
B35_L22_N: U1.L15(IO_L22N_T3_AD7N)
B35_L22_P: U1.L14(IO_L22P_T3_AD7P)
B35_L23_N: U1.M15(IO_L23N_T3)
B35_L23_P: U1.M14(IO_L23P_T3)
B35_L24_N: U1.J16(IO_L24N_T3_AD15N)
B35_L24_P: U1.K16(IO_L24P_T3_AD15P)
NetG2_3: G2.3(OUT) R15.1
NetR28_1: R28.1 S0.1(A)

Not connected (* = marked no-connect by the designer): G2 1(EN); U1 T5(IO_L19P_T3) T9(IO_L12P_T1_MRCC) U5(IO_L19N_T3_VREF) U7(IO_L11P_T1_SRCC) U8(IO_L17N_T2) U9(IO_L17P_T2) U10(IO_L12N_T1_MRCC) V5(IO_L6N_T0_VREF) V6(IO_L22P_T3) V7(IO_L11N_T1_SRCC) V8(IO_L15P_T2_DQS) V10(IO_L21N_T3_DQS) V11(IO_L21P_T3_DQS) W6(IO_L22N_T3) W8(IO_L15N_T2_DQS) W9(IO_L16N_T2) W10(IO_L16P_T2) W11(IO_L18P_T2) Y6(IO_L13N_T2_MRCC) Y7(IO_L13P_T2_MRCC) Y8(IO_L14N_T2_SRCC) Y9(IO_L14P_T2_SRCC) Y11(IO_L18N_T2) Y12(IO_L20P_T3) Y13(IO_L20N_T3)

### Notes on the sheet
- 所有  L?_P和L_?_N之间走差分线
- (in symbol XC7Z020-CLG400, part B) BANK 13
- (in symbol XC7Z020-CLG400, part C) BANK 34
- (in symbol XC7Z020-CLG400, part D) BANK 35

### Library data of the parts
C8-C10 C12-C23 = CAPACITOR: Generic Capacitor; DPN: *; Manufacturer: *
  C10: Value: 0.1uF
G2 = FXO-HC5: 3.3V HCMOS Oscillator; Manufacturer: Fox Electronics; Value: 33.33MHz; DPN: *
R13 R15 R28 = RESISTOR: Generic Resistor; Manufacturer: *; DPN: *
  R13: Value: 10K
  R15: Value: 33R
  R28: Value: 1K
RESET2 = SW-PB: Switch; Published: 24-Mar-1999; LatestRevisionDate: 17-Jul-2002; LatestRevisionNote: Re-released for DXP Platform.; PackageReference: SPST-2; Publisher: Altium Limited; PackageDescription: Switch; 2 Leads
S0 = LED0: Typical INFRARED GaAs LED; Published: 8-Jun-2000; LatestRevisionDate: 08-Jul-2005; LatestRevisionNote: Mech Layer 1 removed.; PackageReference: LED-0; Publisher: Altium Limited; PackageDescription: LED; 2 Leads
U1 = XC7Z020-CLG400: as U1 on sheet ZYNQ400-DDR; DPN: *; Die: *

## Sheet ZYNQ400-MIO.SchDoc
size A3
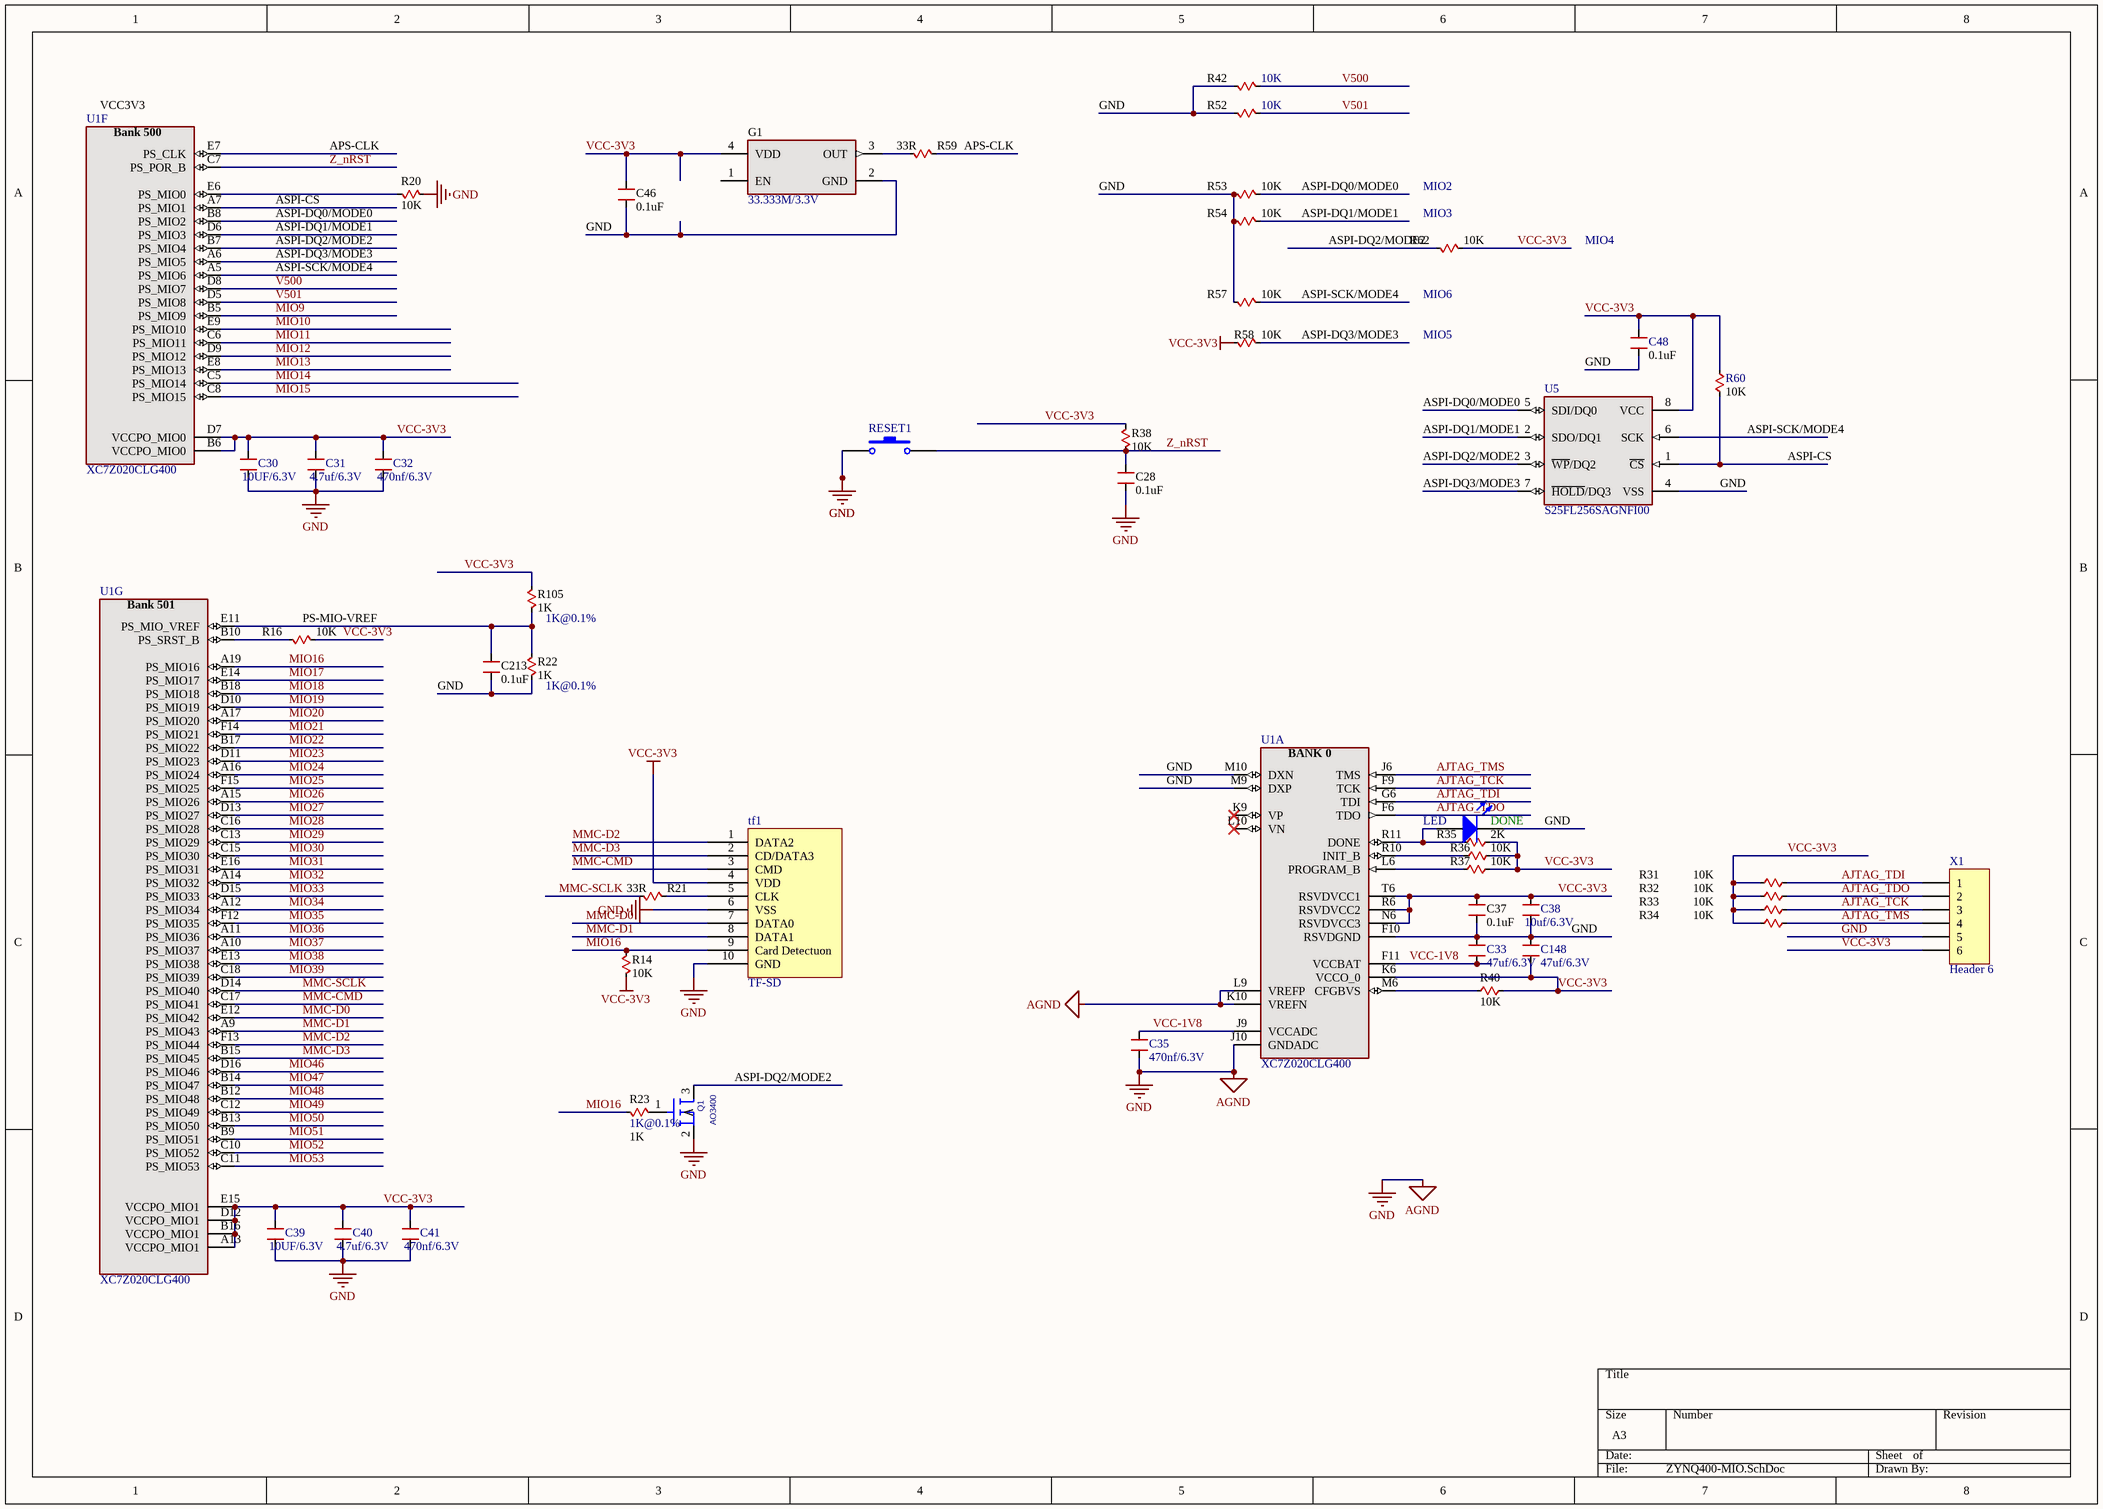
[diagram p4: ZYNQ400-MIO.SchDoc]

### Parts
C28  0.1UF  [0402]
C30  10UF/6.3V  [0402]
C31  4.7uf/6.3V  [0402]
C32  470nf/6.3V  [0402]
C33  47uf/6.3V  [0402]
C35  470nf/6.3V  [0402]
C37  0.1UF  [0402]
C38  10uf/6.3V  [0603]
C39  10UF/6.3V  [0402]
C40  4.7uf/6.3V  [0402]
C41  470nf/6.3V  [0402]
C46  0.1UF  [0402]
C48  0.1UF  [0402]
C148  47uf/6.3V  [0402]
C213  0.1uF  [0402]
DONE  LED  [D0402]
G1  33.333M/3.3V  [3.2*2.5]
Q1  AO3400  [SOT23]
R14  10K  [0402]
R16  10K  [0402]
R20  10K  [0402]
R21  33R  [0402]
R22  1K@0.1%  value 1K  [0402]
R23  1K@0.1%  value 1K  [0402]
R31  10K  [0402]
R32  10K  [0402]
R33  10K  [0402]
R34  10K  [0402]
R35  value 2K  [0402]  (hidden comment: 1K)
R36  10K  [0402]
R37  10K  [0402]
R38  10K  [0402]
R40  10K  [0402]
R42  10K  [0402]
R52  10K  [0402]
R53  10K  [0402]
R54  10K  [0402]
R57  10K  [0402]
R58  10K  [0402]
R59  33R  [0402]
R60  10K  [0402]
R62  10K  [0402]
R105  1K@0.1%  value 1K  [0402]
RESET1  SW-PB  [micro button_2_SMD]  (value not drawn)
tf1  TF-SD  [TF]
U1  XC7Z020CLG400  [CLG400]  (parts A,F,G of 9)
U5  S25FL256SAGNFI00  [MLP8]
X1  Header 6  [HDR1X6]

### Nets
GND: C28.2 C30.2 C31.2 C32.2 C33.2 C35.2 C37.2 C38.2 C39.2 C40.2 C41.2 C46.2 C48.2 C148.2 C213.2 DONE.2(K) G1.2(GND) Q1.2(S) R20.1 R22.2 R42.1 R52.1 R53.1 R54.1 R57.1 RESET1.1 tf1.6(VSS) tf1.10(GND) U1.F10(RSVDGND) U1.J10(GNDADC) U1.K10(VREFN) U1.L9(VREFP) U1.M9(DXP) U1.M10(DXN) U5.4(VSS) X1.5  [also labelled AGND]
VCC-3V3: C30.1 C31.1 C32.1 C37.1 C38.1 C39.1 C40.1 C41.1 C46.1 C48.1 C148.1 G1.4(VDD) R14.1 R16.2 R31.1 R32.1 R33.1 R34.1 R35.2 R36.1 R37.2 R38.2 R40.2 R58.1 R60.1 R62.2 R105.1 tf1.4(VDD) U1.A13(VCCPO_MIO1) U1.B6(VCCPO_MIO0) U1.B16(VCCPO_MIO1) U1.D7(VCCPO_MIO0) U1.D12(VCCPO_MIO1) U1.E15(VCCPO_MIO1) U1.K6(VCCO_0) U1.N6(RSVDVCC3) U1.R6(RSVDVCC2) U1.T6(RSVDVCC1) U5.8(VCC) X1.6
AJTAG_TCK: R33.2 U1.F9(TCK) X1.3
AJTAG_TDI: R31.2 U1.G6(TDI) X1.1
AJTAG_TDO: R32.2 U1.F6(TDO) X1.2
AJTAG_TMS: R34.2 U1.J6(TMS) X1.4
APS-CLK: R59.2 U1.E7(PS_CLK)
ASPI-CS: R60.2 U1.A7(PS_MIO1) U5.1(~{CS})
ASPI-DQ0/MODE0: R53.2 U1.B8(PS_MIO2) U5.5(SDI/DQ0)
ASPI-DQ1/MODE1: R54.2 U1.D6(PS_MIO3) U5.2(SDO/DQ1)
ASPI-DQ2/MODE2: Q1.3(D) R62.1 U1.B7(PS_MIO4) U5.3(~{WP}/DQ2)
ASPI-DQ3/MODE3: R58.2 U1.A6(PS_MIO5) U5.7(~{HOLD}/DQ3)
ASPI-SCK/MODE4: R57.2 U1.A5(PS_MIO6) U5.6(SCK)
MIO9: U1.B5(PS_MIO9)
MIO10: U1.E9(PS_MIO10)
MIO11: U1.C6(PS_MIO11)
MIO12: U1.D9(PS_MIO12)
MIO13: U1.E8(PS_MIO13)
MIO14: U1.C5(PS_MIO14)
MIO15: U1.C8(PS_MIO15)
MIO16: R14.2 R23.1 tf1.9(Card_Detectuon) U1.A19(PS_MIO16)
MIO17: U1.E14(PS_MIO17)
MIO18: U1.B18(PS_MIO18)
MIO19: U1.D10(PS_MIO19)
MIO20: U1.A17(PS_MIO20)
MIO21: U1.F14(PS_MIO21)
MIO22: U1.B17(PS_MIO22)
MIO23: U1.D11(PS_MIO23)
MIO24: U1.A16(PS_MIO24)
MIO25: U1.F15(PS_MIO25)
MIO26: U1.A15(PS_MIO26)
MIO27: U1.D13(PS_MIO27)
MIO28: U1.C16(PS_MIO28)
MIO29: U1.C13(PS_MIO29)
MIO30: U1.C15(PS_MIO30)
MIO31: U1.E16(PS_MIO31)
MIO32: U1.A14(PS_MIO32)
MIO33: U1.D15(PS_MIO33)
MIO34: U1.A12(PS_MIO34)
MIO35: U1.F12(PS_MIO35)
MIO36: U1.A11(PS_MIO36)
MIO37: U1.A10(PS_MIO37)
MIO38: U1.E13(PS_MIO38)
MIO39: U1.C18(PS_MIO39)
MIO46: U1.D16(PS_MIO46)
MIO47: U1.B14(PS_MIO47)
MIO48: U1.B12(PS_MIO48)
MIO49: U1.C12(PS_MIO49)
MIO50: U1.B13(PS_MIO50)
MIO51: U1.B9(PS_MIO51)
MIO52: U1.C10(PS_MIO52)
MIO53: U1.C11(PS_MIO53)
MMC-CMD: tf1.3(CMD) U1.C17(PS_MIO41)
MMC-D0: tf1.7(DATA0) U1.E12(PS_MIO42)
MMC-D1: tf1.8(DATA1) U1.A9(PS_MIO43)
MMC-D2: tf1.1(DATA2) U1.F13(PS_MIO44)
MMC-D3: tf1.2(CD/DATA3) U1.B15(PS_MIO45)
MMC-SCLK: R21.1 U1.D14(PS_MIO40)
PS-MIO-VREF: C213.1 R22.1 R105.2 U1.E11(PS_MIO_VREF)
V500: R42.2 U1.D8(PS_MIO7)
V501: R52.2 U1.D5(PS_MIO8)
VCC-1V8: C33.1 C35.1 U1.F11(VCCBAT) U1.J9(VCCADC)
Z_nRST: C28.1 R38.1 RESET1.2 U1.C7(PS_POR_B)
NetDONE_1: DONE.1(A) R35.1 U1.R11(DONE)
NetG1_3: G1.3(OUT) R59.1
NetQ1_1: Q1.1(G) R23.2
NetR16_1: R16.1 U1.B10(PS_SRST_B)
NetR20_2: R20.2 U1.E6(PS_MIO0)
NetR21_2: R21.2 tf1.5(CLK)
NetR36_2: R36.2 U1.R10(INIT_B)
NetR37_1: R37.1 U1.L6(PROGRAM_B)
NetR40_1: R40.1 U1.M6(CFGBVS)

Not connected (* = marked no-connect by the designer): G1 1(EN); U1 K9(VP)* L10(VN)*

### Notes on the sheet
- VCC3V3
- MIO2
- (near R62) MIO3
- MIO4
- (near R62) MIO6
- MIO5
- (in symbol XC7Z020-CLG400, part A) BANK 0
- (in symbol XC7Z020-CLG400, part F) Bank 500
- (in symbol XC7Z020-CLG400, part G) Bank 501

### Library data of the parts
C28 C30-C33 C35 C37-C41 C46 C48 C148 C213 = CAPACITOR: Generic Capacitor; DPN: *; Manufacturer: *
  C28 C37 C46 C48 C213: Value: 0.1uF
DONE = LED0: Typical INFRARED GaAs LED; Published: 8-Jun-2000; LatestRevisionDate: 08-Jul-2005; LatestRevisionNote: Mech Layer 1 removed.; PackageReference: LED-0; Publisher: Altium Limited; PackageDescription: LED; 2 Leads
G1 = FXO-HC5: as G2 on sheet ZYNQ400-EMIO; DPN: *
Q1 = AO3400: PSpiceTemplate: X^@REFDES %d %g %s @MODEL
R14 R16 R20-R23 R31-R38 R40 R42 R52-R54 R57-R60 R62 R105 = RESISTOR: Generic Resistor; Manufacturer: *; DPN: *
  R14 R16 R20 R31-R34 R36-R38 R40 R42 R52-R54 R57 R58 R60 R62: Value: 10K
  R21 R59: Value: 33R
RESET1 = SW-PB: Switch; Published: 24-Mar-1999; LatestRevisionDate: 17-Jul-2002; LatestRevisionNote: Re-released for DXP Platform.; PackageReference: SPST-2; Publisher: Altium Limited; PackageDescription: Switch; 2 Leads
U1 = XC7Z020-CLG400: as U1 on sheet ZYNQ400-DDR; DPN: *; Die: *
U5 = N25Q12-F8: Serial Flash Memory, 16Mbit, Low Voltage, 50MHz SPI Bus Interface; Manufacturer: Spansion; DPN: *
X1 = Header 6: Header, 6-Pin; LatestRevisionDate: 17-Jul-2002; LatestRevisionNote: Re-released for DXP Platform.; Publisher: Altium Limited
tf1 = TF-SD: Parameter 1: *

## Sheet ZYNQ400-POWER.SchDoc
size A3
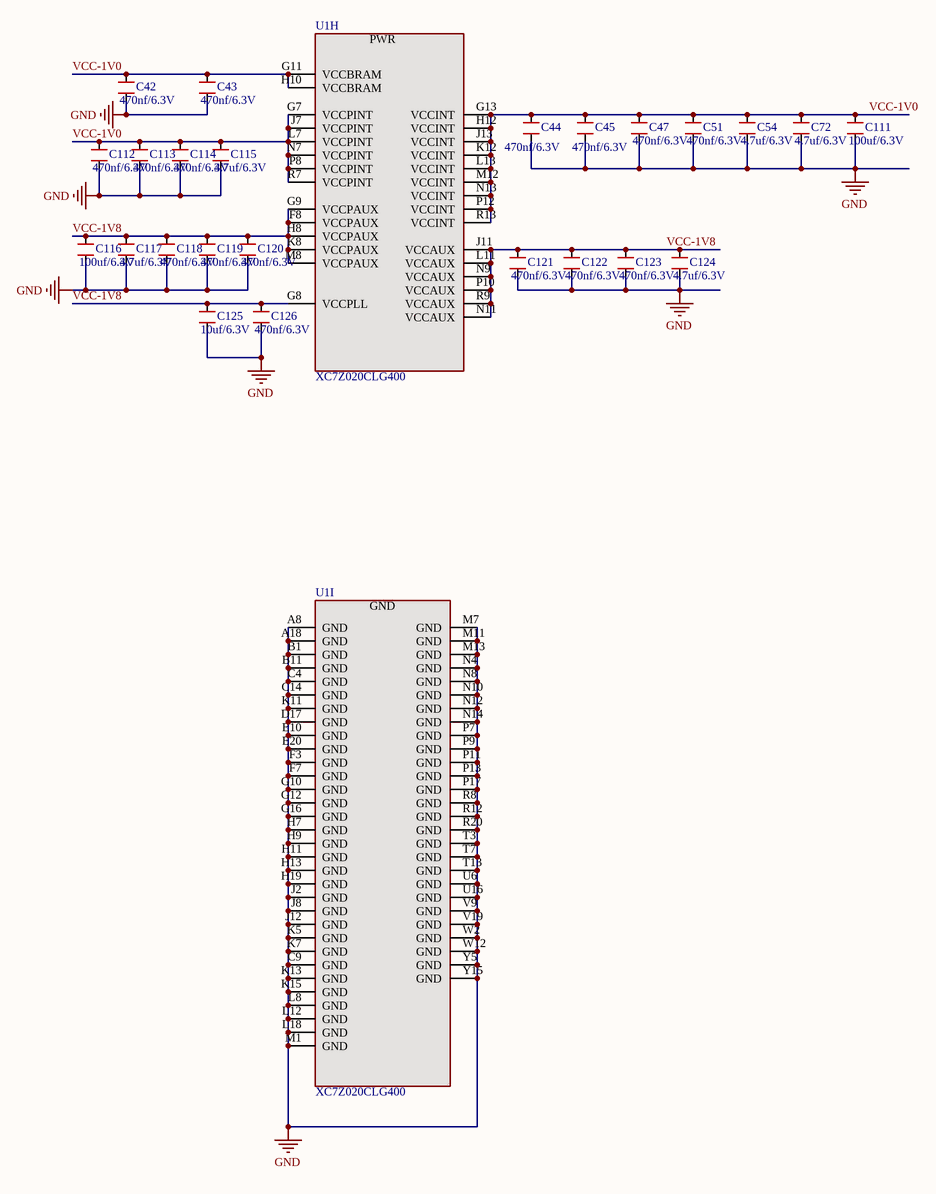
[diagram p5: ZYNQ400-POWER.SchDoc]

### Parts
C42  470nf/6.3V  [0402]
C43  470nf/6.3V  [0402]
C44  470nf/6.3V  [0402]
C45  470nf/6.3V  [0402]
C47  470nf/6.3V  [0402]
C51  470nf/6.3V  [0402]
C54  4.7uf/6.3V  [0402]
C72  4.7uf/6.3V  [0402]
C111  100uf/6.3V  [0805]
C112  470nf/6.3V  [0402]
C113  470nf/6.3V  [0402]
C114  470nf/6.3V  [0402]
C115  4.7uf/6.3V  [0402]
C116  100uf/6.3V  [0805]
C117  4.7uf/6.3V  [0402]
C118  470nf/6.3V  [0402]
C119  470nf/6.3V  [0402]
C120  470nf/6.3V  [0402]
C121  470nf/6.3V  [0402]
C122  470nf/6.3V  [0402]
C123  470nf/6.3V  [0402]
C124  4.7uf/6.3V  [0402]
C125  10uf/6.3V  [0603]
C126  470nf/6.3V  [0402]
U1  XC7Z020CLG400  [CLG400]  (parts H,I of 9)

### Nets
GND: C42.2 C43.2 C44.2 C45.2 C47.2 C51.2 C54.2 C72.2 C111.2 C112.2 C113.2 C114.2 C115.2 C116.2 C117.2 C118.2 C119.2 C120.2 C121.2 C122.2 C123.2 C124.2 C125.2 C126.2 U1.A8(GND) U1.A18(GND) U1.B1(GND) U1.B11(GND) U1.C4(GND) U1.C9(GND) U1.C14(GND) U1.D17(GND) U1.E10(GND) U1.E20(GND) U1.F3(GND) U1.F7(GND) U1.G10(GND) U1.G12(GND) U1.G16(GND) U1.H7(GND) U1.H9(GND) U1.H11(GND) U1.H13(GND) U1.H19(GND) U1.J2(GND) U1.J8(GND) U1.J12(GND) U1.K5(GND) U1.K7(GND) U1.K11(GND) U1.K13(GND) U1.K15(GND) U1.L8(GND) U1.L12(GND) U1.L18(GND) U1.M1(GND) U1.M7(GND) U1.M11(GND) U1.M13(GND) U1.N4(GND) U1.N8(GND) U1.N10(GND) U1.N12(GND) U1.N14(GND) U1.P7(GND) U1.P9(GND) U1.P11(GND) U1.P13(GND) U1.P17(GND) U1.R8(GND) U1.R12(GND) U1.R20(GND) U1.T3(GND) U1.T7(GND) U1.T13(GND) U1.U6(GND) U1.U16(GND) U1.V9(GND) U1.V19(GND) U1.W2(GND) U1.W12(GND) U1.Y5(GND) U1.Y15(GND)
VCC-1V0: C42.1 C43.1 C44.1 C45.1 C47.1 C51.1 C54.1 C72.1 C111.1 C112.1 C113.1 C114.1 C115.1 U1.G7(VCCPINT) U1.G11(VCCBRAM) U1.G13(VCCINT) U1.H10(VCCBRAM) U1.H12(VCCINT) U1.J7(VCCPINT) U1.J13(VCCINT) U1.K12(VCCINT) U1.L7(VCCPINT) U1.L13(VCCINT) U1.M12(VCCINT) U1.N7(VCCPINT) U1.N13(VCCINT) U1.P8(VCCPINT) U1.P12(VCCINT) U1.R7(VCCPINT) U1.R13(VCCINT)
VCC-1V8: C116.1 C117.1 C118.1 C119.1 C120.1 C121.1 C122.1 C123.1 C124.1 C125.1 C126.1 U1.F8(VCCPAUX) U1.G8(VCCPLL) U1.G9(VCCPAUX) U1.H8(VCCPAUX) U1.J11(VCCAUX) U1.K8(VCCPAUX) U1.L11(VCCAUX) U1.M8(VCCPAUX) U1.N9(VCCAUX) U1.N11(VCCAUX) U1.P10(VCCAUX) U1.R9(VCCAUX)

### Notes on the sheet
- (in symbol XC7Z020-CLG400, part H) PWR

### Library data of the parts
C42-C45 C47 C51 C54 C72 C111-C126 = CAPACITOR: Generic Capacitor; DPN: *; Manufacturer: *
U1 = XC7Z020-CLG400: as U1 on sheet ZYNQ400-DDR; DPN: *; Die: *

## Nets that join several sheets
DDR3_VREF: SYS-PS (C6.2 C7.2 U14.6), ZYNQ400-DDR (U1.H6 U1.P6 U6.H1 U6.M8)
GND: SYS-PS (67 pins), ZYNQ400-CONDIP (23 pins), ZYNQ400-DDR (24 pins), ZYNQ400-EMIO (17 pins), ZYNQ400-MIO (36 pins), ZYNQ400-POWER (83 pins)
VCC-1V5: SYS-PS (17 pins), ZYNQ400-DDR (25 pins)
VCC-3V3: SYS-PS (11 pins), ZYNQ400-CONDIP (6 pins), ZYNQ400-EMIO (34 pins), ZYNQ400-MIO (40 pins)
AJTAG_TCK: ZYNQ400-CONDIP (M1.J2_28), ZYNQ400-MIO (R33.2 U1.F9 X1.3)
AJTAG_TDI: ZYNQ400-CONDIP (M1.J2_27), ZYNQ400-MIO (R31.2 U1.G6 X1.1)
AJTAG_TDO: ZYNQ400-CONDIP (M1.J2_23), ZYNQ400-MIO (R32.2 U1.F6 X1.2)
AJTAG_TMS: ZYNQ400-CONDIP (M1.J2_24), ZYNQ400-MIO (R34.2 U1.J6 X1.4)
ASPI-CS: ZYNQ400-CONDIP (M1.J2_16), ZYNQ400-MIO (R60.2 U1.A7 U5.1)
ASPI-DQ0/MODE0: ZYNQ400-CONDIP (M1.J2_19), ZYNQ400-MIO (R53.2 U1.B8 U5.5)
ASPI-DQ1/MODE1: ZYNQ400-CONDIP (M1.J2_11), ZYNQ400-MIO (R54.2 U1.D6 U5.2)
ASPI-DQ2/MODE2: ZYNQ400-CONDIP (M1.J2_15), ZYNQ400-MIO (Q1.3 R62.1 U1.B7 U5.3)
ASPI-DQ3/MODE3: ZYNQ400-CONDIP (M1.J2_12), ZYNQ400-MIO (R58.2 U1.A6 U5.7)
ASPI-SCK/MODE4: ZYNQ400-CONDIP (M1.J2_8), ZYNQ400-MIO (R57.2 U1.A5 U5.6)
B34_L2_N: ZYNQ400-CONDIP (M1.J1_47), ZYNQ400-EMIO (U1.U12)
B34_L2_P: ZYNQ400-CONDIP (M1.J1_48), ZYNQ400-EMIO (U1.T12)
B34_L3_N: ZYNQ400-CONDIP (M1.J1_53), ZYNQ400-EMIO (U1.V13)
B34_L3_P: ZYNQ400-CONDIP (M1.J1_45), ZYNQ400-EMIO (U1.U13)
B34_L4_N: ZYNQ400-CONDIP (M1.J1_51), ZYNQ400-EMIO (U1.W13)
B34_L4_P: ZYNQ400-CONDIP (M1.J1_49), ZYNQ400-EMIO (U1.V12)
B34_L5_P: ZYNQ400-CONDIP (M1.J1_46), ZYNQ400-EMIO (U1.T14)
B34_L7_N: ZYNQ400-CONDIP (M1.J1_66), ZYNQ400-EMIO (U1.Y17)
B34_L7_P: ZYNQ400-CONDIP (M1.J1_61), ZYNQ400-EMIO (U1.Y16)
B34_L8_N: ZYNQ400-CONDIP (M1.J1_55), ZYNQ400-EMIO (U1.Y14)
B34_L8_P: ZYNQ400-CONDIP (M1.J1_57), ZYNQ400-EMIO (U1.W14)
B34_L9_N: ZYNQ400-CONDIP (M1.J1_38), ZYNQ400-EMIO (U1.U17)
B34_L9_P: ZYNQ400-CONDIP (M1.J1_39), ZYNQ400-EMIO (U1.T16)
B34_L10_N: ZYNQ400-CONDIP (M1.J1_59), ZYNQ400-EMIO (U1.W15)
B34_L10_P: ZYNQ400-CONDIP (M1.J1_44), ZYNQ400-EMIO (U1.V15)
B34_L11_N: ZYNQ400-CONDIP (M1.J1_41), ZYNQ400-EMIO (U1.U15)
B34_L11_P: ZYNQ400-CONDIP (M1.J1_43), ZYNQ400-EMIO (U1.U14)
B34_L12_N: ZYNQ400-CONDIP (M1.J1_36), ZYNQ400-EMIO (U1.U19)
B34_L13_N: ZYNQ400-CONDIP (M1.J1_31), ZYNQ400-EMIO (U1.P19)
B34_L13_P: ZYNQ400-CONDIP (M1.J1_32), ZYNQ400-EMIO (U1.N18)
B34_L14_N: ZYNQ400-CONDIP (M1.J1_29), ZYNQ400-EMIO (U1.P20)
B34_L14_P: ZYNQ400-CONDIP (M1.J1_30), ZYNQ400-EMIO (U1.N20)
B34_L15_N: ZYNQ400-CONDIP (M1.J1_56), ZYNQ400-EMIO (U1.U20)
B34_L15_P: ZYNQ400-CONDIP (M1.J1_58), ZYNQ400-EMIO (U1.T20)
B34_L16_N: ZYNQ400-CONDIP (M1.J1_52), ZYNQ400-EMIO (U1.W20)
B34_L16_P: ZYNQ400-CONDIP (M1.J1_54), ZYNQ400-EMIO (U1.V20)
B34_L17_N: ZYNQ400-CONDIP (M1.J1_60), ZYNQ400-EMIO (U1.Y19)
B34_L17_P: ZYNQ400-CONDIP (M1.J1_64), ZYNQ400-EMIO (U1.Y18)
B34_L18_N: ZYNQ400-CONDIP (M1.J1_63), ZYNQ400-EMIO (R13.1 RESET2.2 U1.W16)
B34_L18_P: ZYNQ400-CONDIP (M1.J1_42), ZYNQ400-EMIO (U1.V16)
B34_L19_N: ZYNQ400-CONDIP (M1.J1_34), ZYNQ400-EMIO (U1.R17)
B34_L19_P: ZYNQ400-CONDIP (M1.J1_33), ZYNQ400-EMIO (U1.R16)
B34_L21_N: ZYNQ400-CONDIP (M1.J1_37), ZYNQ400-EMIO (U1.V18)
B34_L21_P: ZYNQ400-CONDIP (M1.J1_40), ZYNQ400-EMIO (U1.V17)
B34_L22_N: ZYNQ400-CONDIP (M1.J1_50), ZYNQ400-EMIO (U1.W19)
B34_L22_P: ZYNQ400-CONDIP (M1.J1_62), ZYNQ400-EMIO (U1.W18)
B34_L23_N: ZYNQ400-CONDIP (M1.J1_27), ZYNQ400-EMIO (U1.P18)
B34_L23_P: ZYNQ400-CONDIP (M1.J1_28), ZYNQ400-EMIO (U1.N17)
B35_L1_N: ZYNQ400-CONDIP (M1.J2_70), ZYNQ400-EMIO (U1.B20)
B35_L1_P: ZYNQ400-CONDIP (M1.J2_69), ZYNQ400-EMIO (U1.C20)
B35_L2_N: ZYNQ400-CONDIP (M1.J2_68), ZYNQ400-EMIO (U1.A20)
B35_L2_P: ZYNQ400-CONDIP (M1.J2_67), ZYNQ400-EMIO (U1.B19)
B35_L3_N: ZYNQ400-CONDIP (M1.J2_72), ZYNQ400-EMIO (U1.D18)
B35_L3_P: ZYNQ400-CONDIP (M1.J2_71), ZYNQ400-EMIO (U1.E17)
B35_L4_N: ZYNQ400-CONDIP (M1.J2_74), ZYNQ400-EMIO (U1.D20)
B35_L4_P: ZYNQ400-CONDIP (M1.J2_73), ZYNQ400-EMIO (U1.D19)
B35_L5_N: ZYNQ400-CONDIP (M1.J2_76), ZYNQ400-EMIO (U1.E19)
B35_L5_P: ZYNQ400-CONDIP (M1.J2_75), ZYNQ400-EMIO (U1.E18)
B35_L6_N: ZYNQ400-CONDIP (M1.J2_78), ZYNQ400-EMIO (U1.F17)
B35_L6_P: ZYNQ400-CONDIP (M1.J2_77), ZYNQ400-EMIO (U1.F16)
B35_L7_N: ZYNQ400-CONDIP (M1.J1_26), ZYNQ400-EMIO (U1.M20)
B35_L7_P: ZYNQ400-CONDIP (M1.J1_25), ZYNQ400-EMIO (U1.M19)
B35_L8_N: ZYNQ400-CONDIP (M1.J1_23), ZYNQ400-EMIO (U1.M18)
B35_L8_P: ZYNQ400-CONDIP (M1.J1_24), ZYNQ400-EMIO (U1.M17)
B35_L9_N: ZYNQ400-CONDIP (M1.J1_19), ZYNQ400-EMIO (U1.L20)
B35_L9_P: ZYNQ400-CONDIP (M1.J1_20), ZYNQ400-EMIO (U1.L19)
B35_L10_N: ZYNQ400-CONDIP (M1.J1_16), ZYNQ400-EMIO (U1.J19)
B35_L10_P: ZYNQ400-CONDIP (M1.J1_15), ZYNQ400-EMIO (U1.K19)
B35_L12_N: ZYNQ400-CONDIP (M1.J1_17), ZYNQ400-EMIO (U1.K18)
B35_L12_P: ZYNQ400-CONDIP (M1.J1_18), ZYNQ400-EMIO (U1.K17)
B35_L14_N: ZYNQ400-CONDIP (M1.J1_12), ZYNQ400-EMIO (U1.H18)
B35_L14_P: ZYNQ400-CONDIP (M1.J1_11), ZYNQ400-EMIO (U1.J18)
B35_L15_N: ZYNQ400-CONDIP (M1.J2_80 P1.1), ZYNQ400-EMIO (U1.F20)
B35_L15_P: ZYNQ400-CONDIP (M1.J2_79 P1.2), ZYNQ400-EMIO (U1.F19)
B35_L16_N: ZYNQ400-CONDIP (M1.J1_8), ZYNQ400-EMIO (U1.G18)
B35_L16_P: ZYNQ400-CONDIP (M1.J1_7), ZYNQ400-EMIO (U1.G17)
B35_L17_N: ZYNQ400-CONDIP (M1.J1_14), ZYNQ400-EMIO (U1.H20)
B35_L17_P: ZYNQ400-CONDIP (M1.J1_13), ZYNQ400-EMIO (U1.J20)
B35_L18_N: ZYNQ400-CONDIP (M1.J1_9), ZYNQ400-EMIO (U1.G20)
B35_L18_P: ZYNQ400-CONDIP (M1.J1_10), ZYNQ400-EMIO (U1.G19)
B35_L24_N: ZYNQ400-CONDIP (M1.J1_21), ZYNQ400-EMIO (U1.J16)
B35_L24_P: ZYNQ400-CONDIP (M1.J1_22), ZYNQ400-EMIO (U1.K16)
MIO9: ZYNQ400-CONDIP (M1.J2_21), ZYNQ400-MIO (U1.B5)
MIO10: ZYNQ400-CONDIP (M1.J2_33), ZYNQ400-MIO (U1.E9)
MIO12: ZYNQ400-CONDIP (M1.J2_32), ZYNQ400-MIO (U1.D9)
MIO13: ZYNQ400-CONDIP (M1.J2_29), ZYNQ400-MIO (U1.E8)
MIO14: ZYNQ400-CONDIP (M1.J2_22), ZYNQ400-MIO (U1.C5)
MIO15: ZYNQ400-CONDIP (M1.J2_31), ZYNQ400-MIO (U1.C8)
MIO16: ZYNQ400-CONDIP (M1.J2_66), ZYNQ400-MIO (R14.2 R23.1 tf1.9 U1.A19)
MIO18: ZYNQ400-CONDIP (M1.J2_65), ZYNQ400-MIO (U1.B18)
MIO19: ZYNQ400-CONDIP (M1.J2_34), ZYNQ400-MIO (U1.D10)
MIO20: ZYNQ400-CONDIP (M1.J2_63), ZYNQ400-MIO (U1.A17)
MIO22: ZYNQ400-CONDIP (M1.J2_64), ZYNQ400-MIO (U1.B17)
MIO23: ZYNQ400-CONDIP (M1.J2_39), ZYNQ400-MIO (U1.D11)
MIO24: ZYNQ400-CONDIP (M1.J2_62), ZYNQ400-MIO (U1.A16)
MIO26: ZYNQ400-CONDIP (M1.J2_60), ZYNQ400-MIO (U1.A15)
MIO28: ZYNQ400-CONDIP (M1.J2_50), ZYNQ400-MIO (U1.C16)
MIO29: ZYNQ400-CONDIP (M1.J2_43), ZYNQ400-MIO (U1.C13)
MIO30: ZYNQ400-CONDIP (M1.J2_47), ZYNQ400-MIO (U1.C15)
MIO31: ZYNQ400-CONDIP (M1.J2_52), ZYNQ400-MIO (U1.E16)
MIO32: ZYNQ400-CONDIP (M1.J2_58), ZYNQ400-MIO (U1.A14)
MIO33: ZYNQ400-CONDIP (M1.J2_48), ZYNQ400-MIO (U1.D15)
MIO34: ZYNQ400-CONDIP (M1.J2_55), ZYNQ400-MIO (U1.A12)
MIO35: ZYNQ400-CONDIP (M1.J2_42), ZYNQ400-MIO (U1.F12)
MIO36: ZYNQ400-CONDIP (M1.J2_54), ZYNQ400-MIO (U1.A11)
MIO37: ZYNQ400-CONDIP (M1.J2_36), ZYNQ400-MIO (U1.A10)
MIO38: ZYNQ400-CONDIP (M1.J2_44), ZYNQ400-MIO (U1.E13)
MIO39: ZYNQ400-CONDIP (M1.J2_53), ZYNQ400-MIO (U1.C18)
MIO46: ZYNQ400-CONDIP (M1.J2_49), ZYNQ400-MIO (U1.D16)
MIO47: ZYNQ400-CONDIP (M1.J2_59), ZYNQ400-MIO (U1.B14)
MIO48: ZYNQ400-CONDIP (M1.J2_56), ZYNQ400-MIO (U1.B12)
MIO49: ZYNQ400-CONDIP (M1.J2_40), ZYNQ400-MIO (U1.C12)
MIO51: ZYNQ400-CONDIP (M1.J2_30), ZYNQ400-MIO (U1.B9)
MIO52: ZYNQ400-CONDIP (M1.J2_37), ZYNQ400-MIO (U1.C10)
MIO53: ZYNQ400-CONDIP (M1.J2_38), ZYNQ400-MIO (U1.C11)
MMC-CMD: ZYNQ400-CONDIP (M1.J2_51), ZYNQ400-MIO (tf1.3 U1.C17)
MMC-D0: ZYNQ400-CONDIP (M1.J2_41), ZYNQ400-MIO (tf1.7 U1.E12)
MMC-D1: ZYNQ400-CONDIP (M1.J2_35), ZYNQ400-MIO (tf1.8 U1.A9)
MMC-D2: ZYNQ400-CONDIP (M1.J2_46), ZYNQ400-MIO (tf1.1 U1.F13)
MMC-D3: ZYNQ400-CONDIP (M1.J2_61), ZYNQ400-MIO (tf1.2 U1.B15)
MMC-SCLK: ZYNQ400-CONDIP (M1.J2_45), ZYNQ400-MIO (R21.1 U1.D14)
V500: ZYNQ400-CONDIP (M1.J2_20), ZYNQ400-MIO (R42.2 U1.D8)
V501: ZYNQ400-CONDIP (M1.J2_7), ZYNQ400-MIO (R52.2 U1.D5)
VCC-1V0: SYS-PS (5 pins), ZYNQ400-POWER (30 pins)
VCC-1V8: SYS-PS (5 pins), ZYNQ400-MIO (C33.1 C35.1 U1.F11 U1.J9), ZYNQ400-POWER (23 pins)
VCC-IN: SYS-PS (19 pins), ZYNQ400-CONDIP (6 pins)